# Altium project MainPanel.PrjPcb (part 1 of 2)
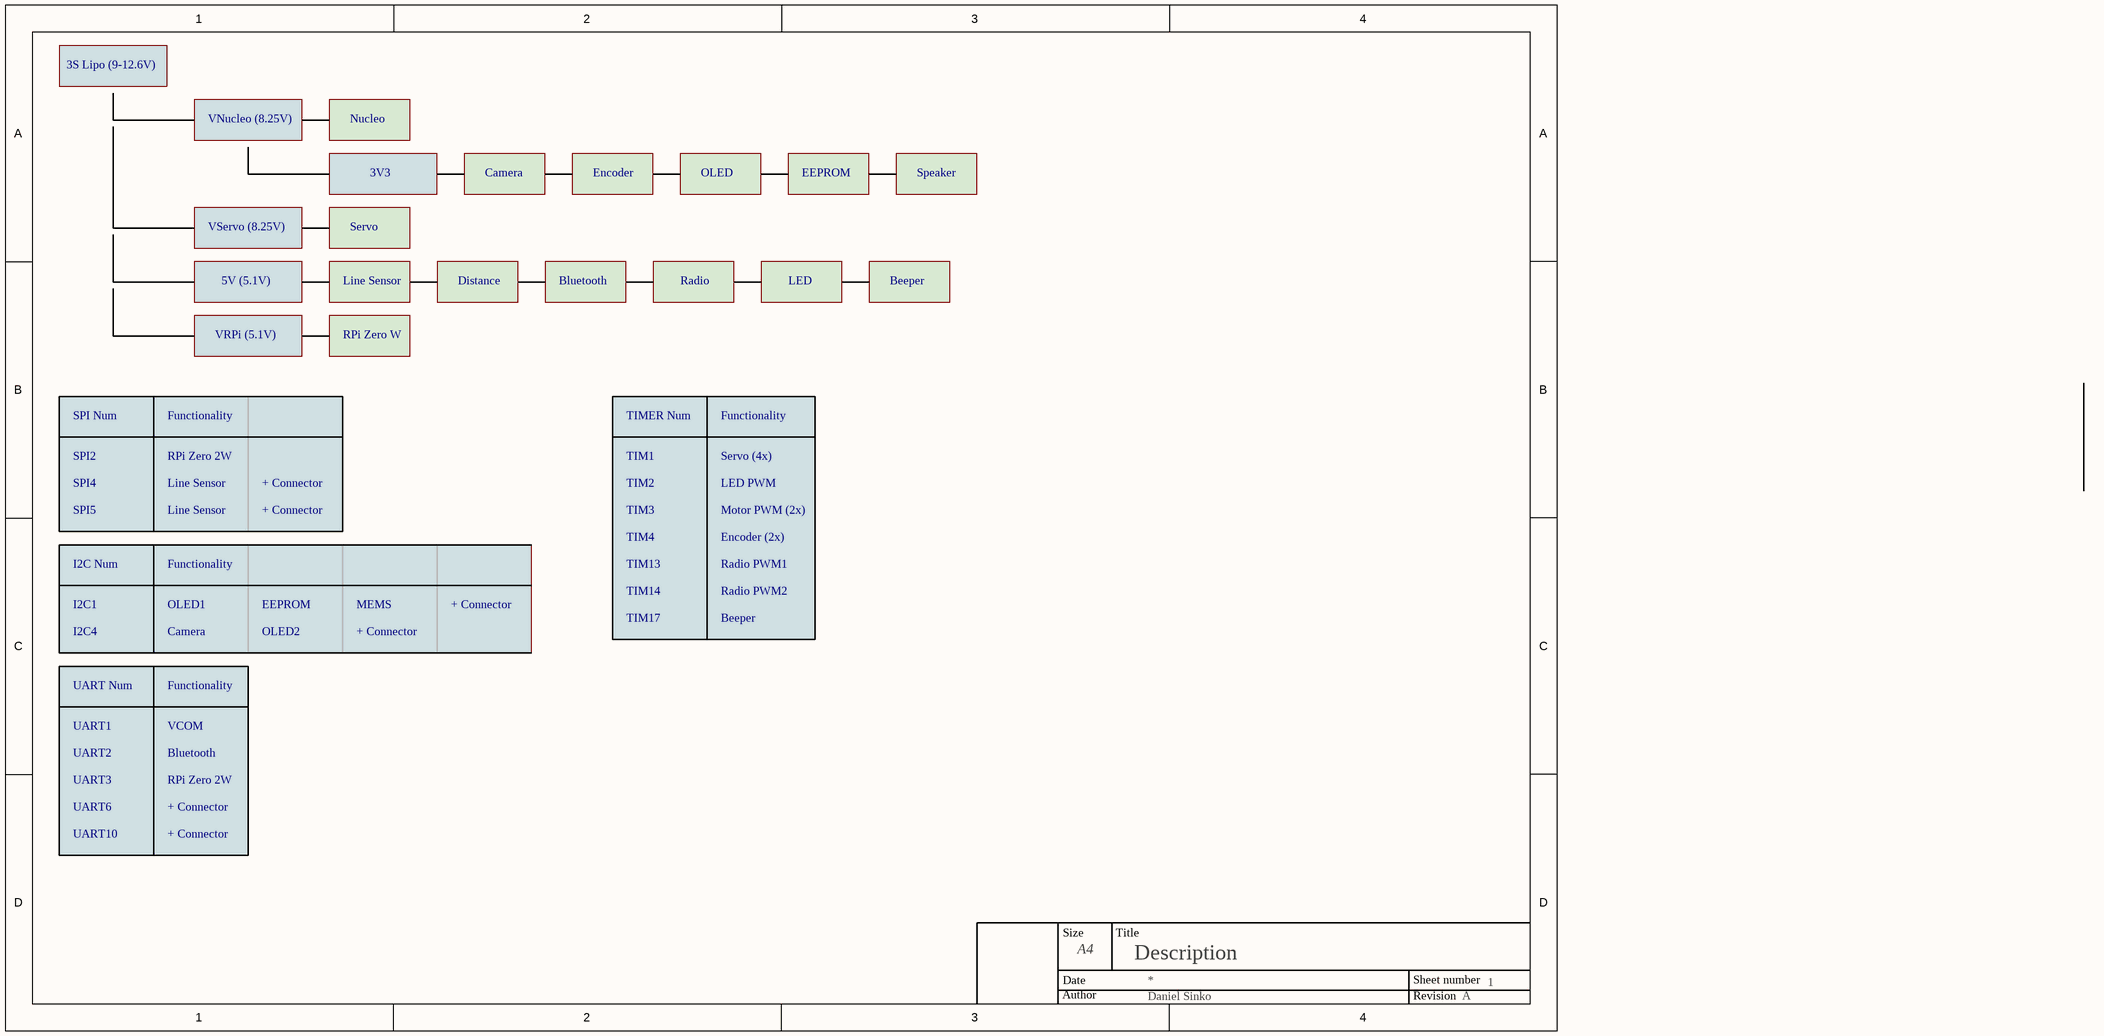
[diagram p0: Description.SchDoc]
15 sheets, 246 parts. Net scope: hierarchical (ports join the sheet entries above them; power ports are global).
Board file: MainPanel.PcbDoc
Sheets:
  Description.SchDoc
  Main.SchDoc
    U_EEPROM = EEPROM.SchDoc
    U_Interface = Interface.SchDoc
    U_Camera = Camera.SchDoc
    U_Communication = Communication.SchDoc
    U_Nucleo = Nucleo.SchDoc
    U_Measurements = Measurements.SchDoc
    U_Power = Power.SchDoc
    U_Encoder = Encoder.SchDoc
    U_Servo = Servo.SchDoc
    U_MotorDriver = MotorDriver.SchDoc
    U_Linesensor = Linesensor.SchDoc
    U_Linesensor = Linesensor.SchDoc
    U_DistanceSensor = DistanceSensor.SchDoc
  ledsbuttons.SchDoc

## Sheet Description.SchDoc: Description
size A4; Author: Daniel Sinko; Revision: A; SheetNumber: 1; SheetTotal: 15

### Notes on the sheet
- 3S Lipo (9-12.6V)
- VNucleo (8.25V)
- Nucleo
- 3V3
- Camera
- Encoder
- OLED
- EEPROM
- Speaker
- VServo (8.25V)
- Servo
- 5V (5.1V)
- Line Sensor
- Distance
- Bluetooth
- Radio
- LED
- Beeper
- VRPi (5.1V)
- RPi Zero W
- SPI Num
- Functionality
- TIMER Num
- SPI2
- SPI4
- SPI5
- RPi Zero 2W
- + Connector
- TIM1
- TIM2
- TIM3
- Servo (4x)
- LED PWM
- Motor PWM (2x)
- I2C Num
- TIM4
- TIM13
- Encoder (2x)
- Radio PWM1
- I2C1
- I2C4
- OLED1
- OLED2
- MEMS
- TIM14
- TIM17
- Radio PWM2
- UART Num
- UART1
- UART2
- UART3
- VCOM
- UART6
- UART10
- Size
- Date
- A4
- Title
- Sheet number
- Author
- Revision

## Sheet Main.SchDoc
size A4; SheetNumber: 2; SheetTotal: 15
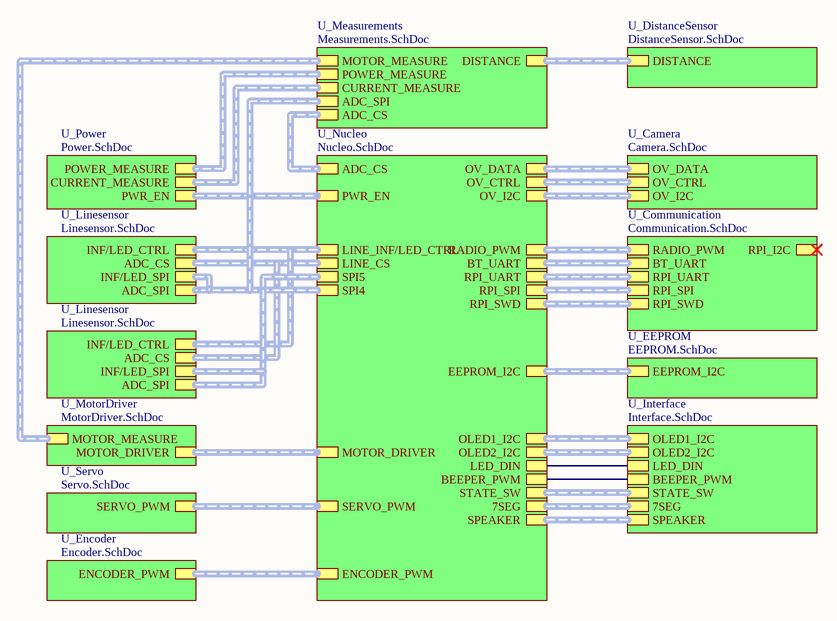
[diagram p1: Main.SchDoc]

### Sub-sheets
U_Camera = Camera.SchDoc: OV_DATA (harness OV_DATA), OV_I2C (harness OV_I2C), OV_CTRL (harness OV_CTRL)
U_Communication = Communication.SchDoc: BT_UART (harness BT_UART), RADIO_PWM (harness RADIO_PWM), RPI_I2C (harness RPi_I2C), RPI_UART (harness RPI_UART), RPI_SPI (harness RPi SPI), RPI_SWD (harness RPI_SWD)
U_DistanceSensor = DistanceSensor.SchDoc: DISTANCE (harness DISTANCE)
U_EEPROM = EEPROM.SchDoc: EEPROM_I2C (harness EEPROM_I2C)
U_Encoder = Encoder.SchDoc: ENCODER_PWM (harness ENCODER_PWM)
U_Interface = Interface.SchDoc: LED_DIN, BEEPER_PWM, STATE_SW, 7SEG, OLED1_I2C (harness OLED1), OLED2_I2C (harness OLED2), SPEAKER (harness SPEAKER)
U_Linesensor = Linesensor.SchDoc: INF/LED_CTRL (harness harness_line_inf), ADC_SPI (harness harness_spi), ADC_CS (harness harness_adc_cs), INF/LED_SPI (harness harness_spi)
U_Linesensor = Linesensor.SchDoc: INF/LED_CTRL (harness harness_line_inf), ADC_SPI (harness harness_spi), ADC_CS (harness harness_adc_cs), INF/LED_SPI (harness harness_spi)
U_Measurements = Measurements.SchDoc: POWER_MEASURE (harness POWER_MEASURE), DISTANCE (harness DISTANCE), MOTOR_MEASURE (harness MOTOR_MEASURE), ADC_SPI (harness ADC_SPI), ADC_CS (harness ADC_CS), CURRENT_MEASURE (harness CURRENT_MEASURE)
U_MotorDriver = MotorDriver.SchDoc: MOTOR_DRIVER (harness MOTOR_DRIVER), MOTOR_MEASURE (harness MOTOR_MEASURE)
U_Nucleo = Nucleo.SchDoc: OV_DATA (harness OV_DATA), LINE_INF/LED_CTRL (harness harness_line_inf), LINE_CS (harness harness_adc_cs), OV_CTRL (harness OV_CTRL), OV_I2C (harness OV_I2C), ENCODER_PWM (harness ENCODER_PWM), RADIO_PWM (harness RADIO_PWM), BT_UART (harness BT_UART), RPI_SPI (harness RPi SPI), RPI_UART (harness RPI_UART), PWR_EN (harness PWR_EN), SERVO_PWM (harness SERVO_PWM), MOTOR_DRIVER (harness MOTOR_DRIVER), LED_DIN, BEEPER_PWM, STATE_SW, 7SEG, RPI_SWD (harness RPI_SWD), EEPROM_I2C (harness EEPROM_I2C), OLED1_I2C (harness OLED1), OLED2_I2C (harness OLED2), SPEAKER (harness SPEAKER), ADC_CS (harness ADC_CS), SPI4 (harness harness_spi), SPI5 (harness harness_spi)
U_Power = Power.SchDoc: PWR_EN (harness PWR_EN), POWER_MEASURE (harness POWER_MEASURE), CURRENT_MEASURE (harness CURRENT_MEASURE)
U_Servo = Servo.SchDoc: SERVO_PWM (harness SERVO_PWM)

### Nets
TIM2_CH3: sheet U_Interface/LED_DIN, sheet U_Nucleo/LED_DIN
TIM17_CH1: sheet U_Interface/BEEPER_PWM, sheet U_Nucleo/BEEPER_PWM

### Buses and harness runs
harness sheet U_Camera/OV_CTRL = sheet U_Nucleo/OV_CTRL
harness sheet U_Camera/OV_DATA = sheet U_Nucleo/OV_DATA
harness sheet U_Camera/OV_I2C = sheet U_Nucleo/OV_I2C
harness sheet U_Communication/BT_UART = sheet U_Nucleo/BT_UART
harness sheet U_Communication/RADIO_PWM = sheet U_Nucleo/RADIO_PWM
harness sheet U_Communication/RPI_SPI = sheet U_Nucleo/RPI_SPI
harness sheet U_Communication/RPI_SWD = sheet U_Nucleo/RPI_SWD
harness sheet U_Communication/RPI_UART = sheet U_Nucleo/RPI_UART
harness sheet U_DistanceSensor/DISTANCE = sheet U_Measurements/DISTANCE
harness sheet U_EEPROM/EEPROM_I2C = sheet U_Nucleo/EEPROM_I2C
harness sheet U_Encoder/ENCODER_PWM = sheet U_Nucleo/ENCODER_PWM
harness sheet U_Interface/7SEG = sheet U_Nucleo/7SEG
harness sheet U_Interface/OLED1_I2C = sheet U_Nucleo/OLED1_I2C
harness sheet U_Interface/OLED2_I2C = sheet U_Nucleo/OLED2_I2C
harness sheet U_Interface/SPEAKER = sheet U_Nucleo/SPEAKER
harness sheet U_Interface/STATE_SW = sheet U_Nucleo/STATE_SW
harness sheet U_Linesensor/ADC_CS = sheet U_Nucleo/LINE_CS
harness sheet U_Linesensor/ADC_SPI = sheet U_Linesensor/INF/LED_SPI = sheet U_Measurements/ADC_SPI = sheet U_Nucleo/SPI4
harness sheet U_Linesensor/ADC_SPI = sheet U_Linesensor/INF/LED_SPI = sheet U_Nucleo/SPI5
harness sheet U_Linesensor/INF/LED_CTRL = sheet U_Nucleo/LINE_INF/LED_CTRL
harness sheet U_Measurements/ADC_CS = sheet U_Nucleo/ADC_CS
harness sheet U_Measurements/CURRENT_MEASURE = sheet U_Power/CURRENT_MEASURE
harness sheet U_Measurements/MOTOR_MEASURE = sheet U_MotorDriver/MOTOR_MEASURE
harness sheet U_Measurements/POWER_MEASURE = sheet U_Power/POWER_MEASURE
harness sheet U_MotorDriver/MOTOR_DRIVER = sheet U_Nucleo/MOTOR_DRIVER
harness sheet U_Nucleo/PWR_EN = sheet U_Power/PWR_EN
harness sheet U_Nucleo/SERVO_PWM = sheet U_Servo/SERVO_PWM

### Notes on the sheet
- Size
- Date
- A4
- Title
- Sheet number
- Author
- Revision

## Sheet EEPROM.SchDoc
size A4; SheetNumber: 13; SheetTotal: 15
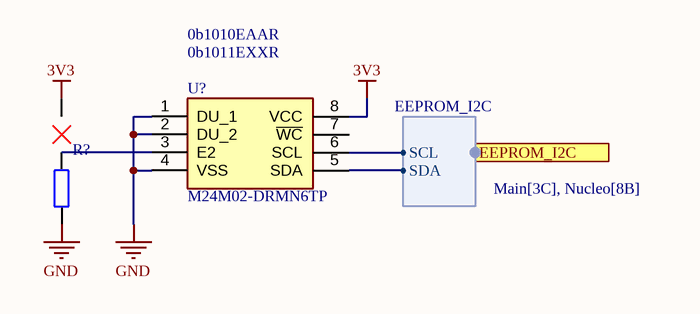
[diagram p2: EEPROM.SchDoc]

### Parts
(Parts that share a designator on the sheet are numbered #1, #2 ... from top to bottom, then left to right.)
R?#1  *  [RES0603 _SELECTION]  (value not drawn)
U?  M24M02-DRMN6TP  [SOIC127P600X175-8N]

### Ports
EEPROM_I2C (harness EEPROM_I2C, see Main[3C], Nucleo[8B])

### Harnesses
EEPROM_I2C: SCL, SDA

### Nets
3V3: R?#1.3 U?.8(VCC)
GND: R?#1.1 U?.1(DU_1) U?.2(DU_2) U?.4(VSS)
I2C1_SCA: U?.5(SDA) ; port EEPROM_I2C.SDA
I2C1_SCL: U?.6(SCL) ; port EEPROM_I2C.SCL
NetR?#1_2: R?#1.2 U?.3(E2)

Not connected (* = marked no-connect by the designer): U? 7(~{WC})

### Notes on the sheet
- 0b1010EAAR
- (near U?) 0b1011EXXR
- Size
- Date
- A4
- Title
- Sheet number
- Author
- Revision

### Library data of the parts
R?#1 = Resistor_Selection: Resistor; Value: *
U? = M24M02-DRMN6TP: Undefined or Miscellaneous; Manufacturer_Name: STMicroelectronics; Datasheet Link: http://www.st.com/content/ccc/resource/technical/document/datasheet/b7/de/9b/f6/03/28/4e/8e/CD00290537.pdf/files/CD00290537.pdf/jcr:content/translations/en.CD00290537.pdf; Height: 1.75mm; Manufacturer_Part_Number: M24M02-DRMN6TP; Mouser Part Number: 511-M24M02-DRMN6TP; Mouser Price/Stock: https://www.mouser.co.uk/ProductDetail/STMicroelectronics/M24M02-DRMN6TP?qs=0gj%2FgiofzsPtgZ8EdVfF5w%3D%3D; Arrow Part Number: M24M02-DRMN6TP; Arrow Price/Stock: https://www.arrow.com/en/products/m24m02-drmn6tp/stmicroelectronics?utm_currency=USD&region=nac

## Sheet Interface.SchDoc
size A4; SheetNumber: 12; SheetTotal: 15
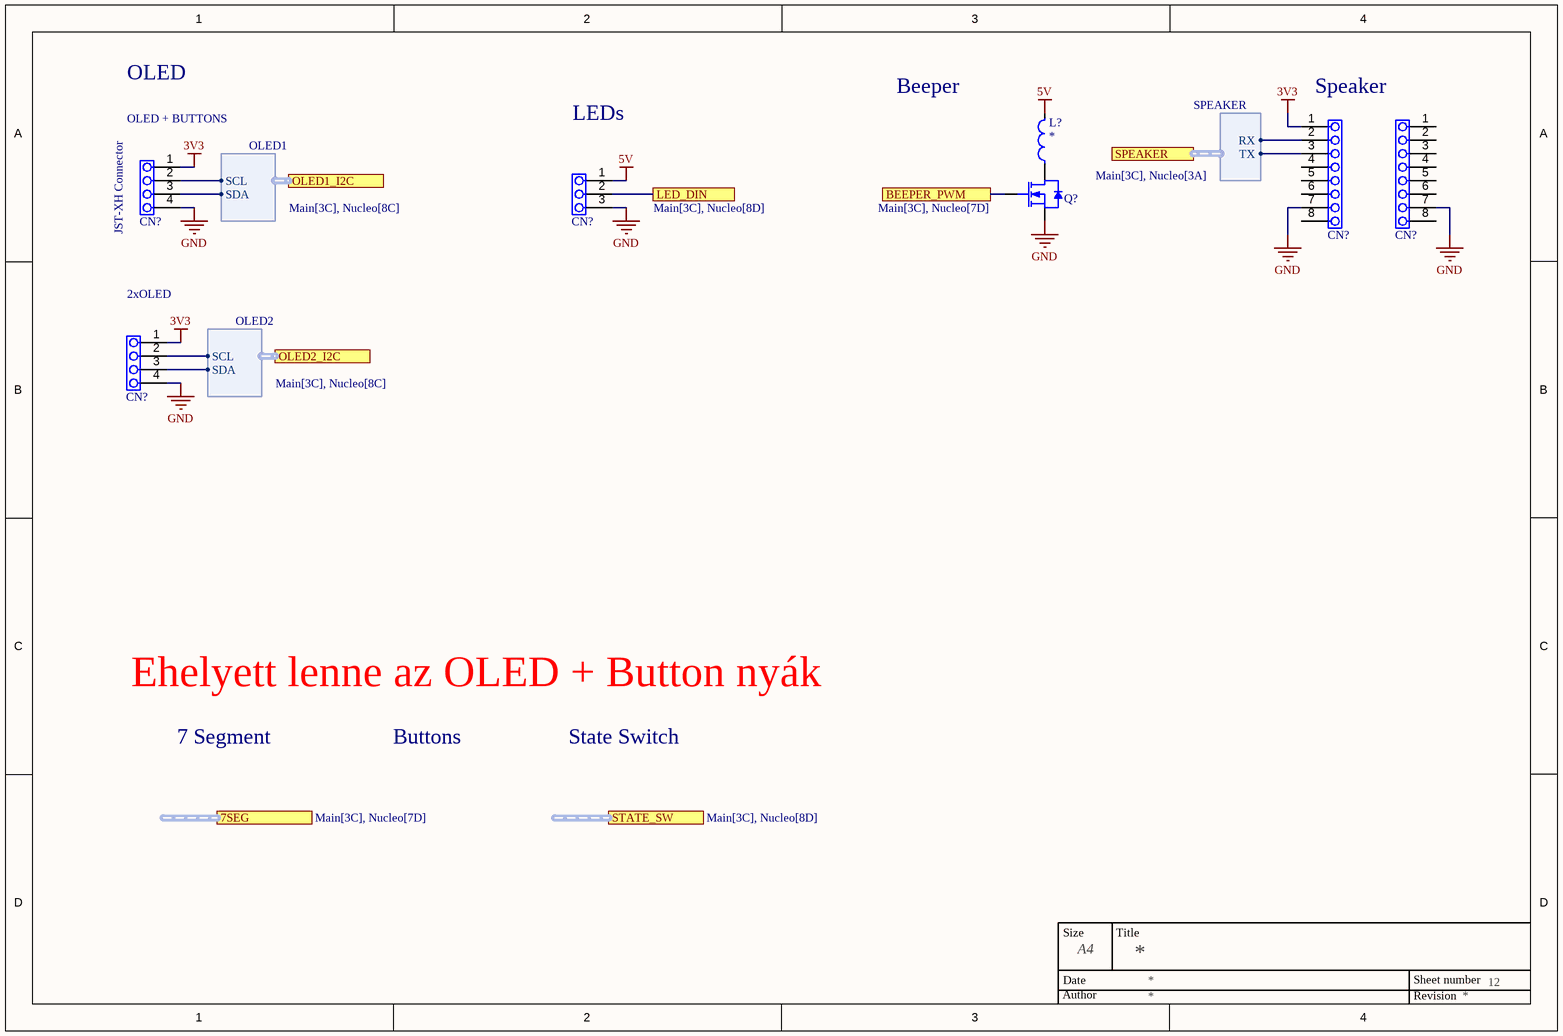
[diagram p3: Interface.SchDoc]

### Parts
(Parts that share a designator on the sheet are numbered #1, #2 ... from top to bottom, then left to right.)
CN?#1  Pin-1x8  [PIN-1X7]  (value not drawn)
CN?#2  Pin-1x8  [PIN-1X7]  (value not drawn)
CN?#3  Pins 1x3  [PIN-1X4]  (value not drawn)
CN?#4  Pins 1x3  [PIN-1X3]  (value not drawn)
CN?#5  Pins 1x3  [PIN-1X4]  (value not drawn)
L?#1  *
Q?#1  N-MOSFET  (value not drawn)

### Ports
7SEG (see Main[3C], Nucleo[7D]), BEEPER_PWM (see Main[3C], Nucleo[7D]), LED_DIN (see Main[3C], Nucleo[8D]), OLED1_I2C (harness OLED1, see Main[3C], Nucleo[8C]), OLED2_I2C (harness OLED2, see Main[3C], Nucleo[8C]), SPEAKER (harness SPEAKER, see Main[3C], Nucleo[3A]), STATE_SW (see Main[3C], Nucleo[8D])

### Harnesses
OLED1: SCL, SDA
OLED2: SCL, SDA
SPEAKER: RX, TX

### Nets
3V3: CN?#1.1 CN?#3.1 CN?#5.1
5V: CN?#4.1 L?#1.2
GND: CN?#1.7 CN?#2.7 CN?#3.4 CN?#4.3 CN?#5.4 Q?#1.2(S)
I2C1_SCA: CN?#3.3 ; port OLED1_I2C.SDA
I2C1_SCL: CN?#3.2 ; port OLED1_I2C.SCL
I2C4_SCA: CN?#5.3 ; port OLED2_I2C.SDA
I2C4_SCL: CN?#5.2 ; port OLED2_I2C.SCL
TIM2_CH3: CN?#4.2 ; port LED_DIN
TIM17_CH1: Q?#1.1(G) ; port BEEPER_PWM
UART6_RX: CN?#1.3 ; port SPEAKER.TX
UART6_TX: CN?#1.2 ; port SPEAKER.RX
NetL?#1_1: L?#1.1 Q?#1.3(D)

Not connected (* = marked no-connect by the designer): CN?#1 4 5 6 8; CN?#2 1 2 3 4 5 6 8

### Notes on the sheet
- OLED
- Beeper
- (near CN?#1) Speaker
- (near CN?#3) OLED + BUTTONS
- LEDs
- (near CN?#3) JST-XH Connector
- (near CN?#5) 2xOLED
- Ehelyett lenne az OLED + Button nyák
- 7 Segment
- Buttons
- State Switch
- Size
- Date
- A4
- Title
- Sheet number
- Author
- Revision

### Library data of the parts
CN?#1 CN?#2 = Pin-1x8: 2.54mm; Part Class: Connector; Order Code: 855-M50-3530342; CompType: M50-3530342; Distributor: Mouser; Package: SMD 1.27mm
CN?#3 CN?#5 = Pin-1x4: 2.54mm; Part Class: Connector; Order Code: 855-M50-3530342; CompType: M50-3530342; Distributor: Mouser; Package: SMD 1.27mm
CN?#4 = Pin-1x3: 2.54mm; Part Class: Connector; Order Code: 855-M50-3530342; CompType: M50-3530342; Distributor: Mouser; Package: SMD 1.27mm
L?#1 = Inductor: Value: *
Q?#1 = N-MOSFET: N channel MOSFET

## Sheet Camera.SchDoc
size A4; SheetNumber: 5; SheetTotal: 15
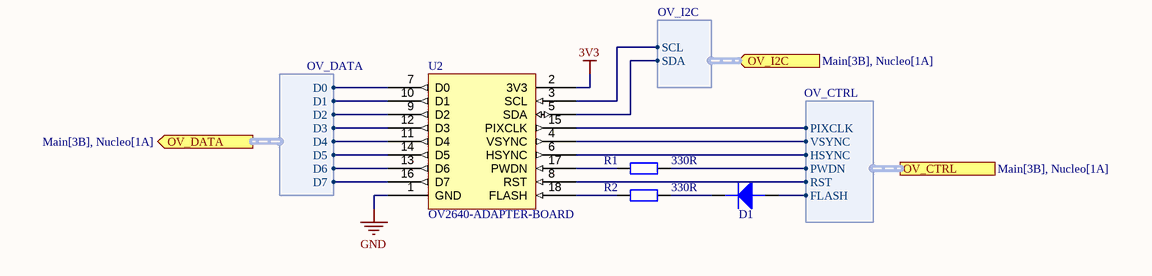
[diagram p4: Camera.SchDoc]

### Parts
D1  Diode  [DIOM4325X24M]  (value not drawn)
R1  330R  [FP_0805_RES]
R2  330R  [FP_0805_RES]
U2  OV2640-ADAPTER-BOARD  [CONNECTOR-18P - 90°]

### Ports
OV_CTRL (harness OV_CTRL, see Main[3B], Nucleo[1A]), OV_DATA (out, harness OV_DATA, see Main[3B], Nucleo[1A]), OV_I2C (in, harness OV_I2C, see Main[3B], Nucleo[1A])

### Harnesses
OV_DATA: D0, D1, D2, D3, D4, D5, D6, D7
OV_I2C: SCL, SDA
OV_CTRL: PIXCLK, VSYNC, HSYNC, RST, PWDN, FLASH

### Nets
3V3: U2.2(3V3)
GND: U2.1(GND)
I2C4_SCL: U2.3(SCL) ; port OV_I2C.SCL
I2C4_SDA: U2.5(SDA) ; port OV_I2C.SDA
OV_D0: U2.7(D0) ; port OV_DATA.D0
OV_D1: U2.10(D1) ; port OV_DATA.D1
OV_D2: U2.9(D2) ; port OV_DATA.D2
OV_D3: U2.12(D3) ; port OV_DATA.D3
OV_D4: U2.11(D4) ; port OV_DATA.D4
OV_D5: U2.14(D5) ; port OV_DATA.D5
OV_D6: U2.13(D6) ; port OV_DATA.D6
OV_D7: U2.16(D7) ; port OV_DATA.D7
OV_FLASH: D1.2(A) ; port OV_CTRL.FLASH
OV_HSYNC: U2.6(HSYNC) ; port OV_CTRL.HSYNC
OV_PIXCLK: U2.15(PIXCLK) ; port OV_CTRL.PIXCLK
OV_PWDN: R1.2 ; port OV_CTRL.PWDN
OV_RST: U2.8(RST) ; port OV_CTRL.RST
OV_VSYNC: U2.4(VSYNC) ; port OV_CTRL.VSYNC
NetD1_1: D1.1(K) R2.2
NetR1_1: R1.1 U2.17(PWDN)
NetR2_1: R2.1 U2.18(FLASH)

### Notes on the sheet
- Size
- Date
- A4
- Title
- Sheet number
- Author
- Revision

### Library data of the parts
D1 = Diode: Name: 1A 40V DO-214AC SCH.RECT. SS14 (YET) SMA-W; Supplier: Lomex; Reference: 83-02-47
R1 R2 = RES: Resistor; Name: 330R 0805 5% CR-05JL7--330R 0.125W (VIK); Supplier: Lomex; Reference: 81-10-81; Value: 330R
U2 = OV2640-ADAPTER-BOARD: Adapter board for OV2640 camera modul; Name: ZL231-18KG; Reference: 100.480.07; Supplier: hestore

## Sheet Communication.SchDoc
size A4; SheetNumber: 11; SheetTotal: 15
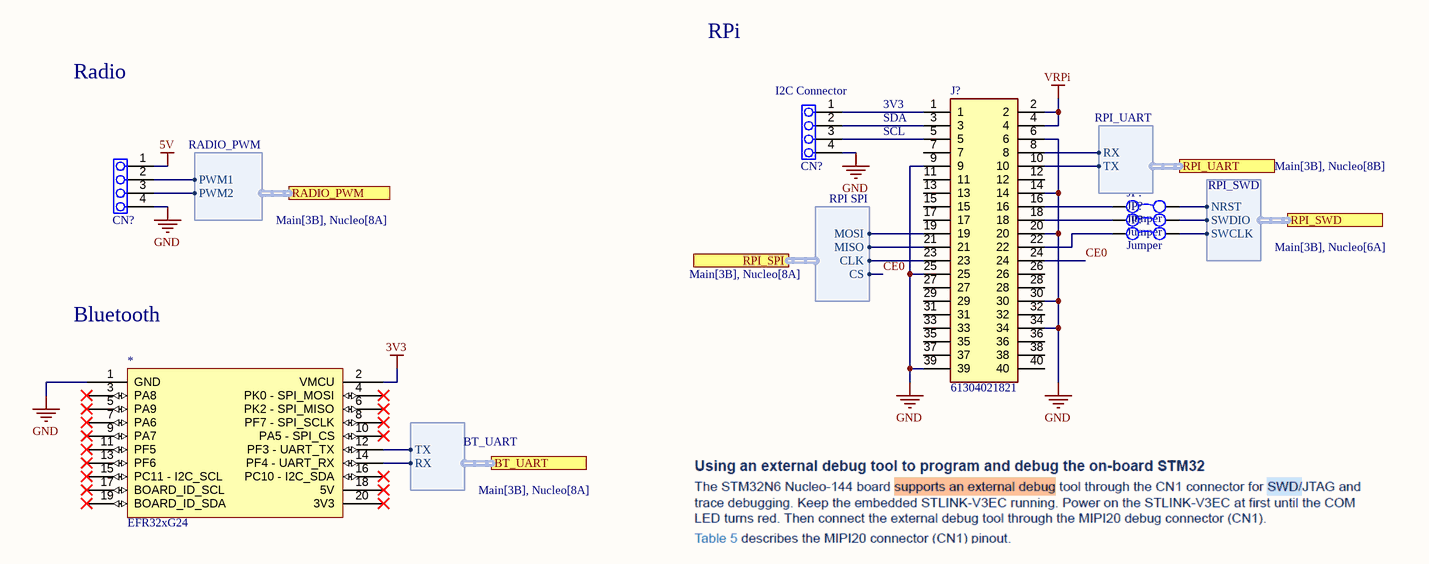
[diagram p5: Communication.SchDoc]

### Parts
(Parts that share a designator on the sheet are numbered #1, #2 ... from top to bottom, then left to right.)
*  EFR32xG24
CN?#6  Pins 1x3  [PIN-1X4]  (value not drawn)
CN?#7  Pins 1x3  [PIN-1X4]  (value not drawn)
J?#1  61304021821  [RHDR40W97P254X254_2X20_5130X508X860P]
JP?#1  Jumper  [PIN-1X2]
JP?#2  Jumper  [PIN-1X2]
JP?#3  Jumper  [PIN-1X2]

### Ports
BT_UART (harness BT_UART, see Main[3B], Nucleo[8A]), RADIO_PWM (harness RADIO_PWM, see Main[3B], Nucleo[8A]), RPI_SPI (harness RPi SPI, see Main[3B], Nucleo[8A]), RPI_SWD (harness RPI_SWD, see Main[3B], Nucleo[6A]), RPI_UART (harness RPI_UART, see Main[3B], Nucleo[8B])

### Harnesses
RADIO_PWM: PWM1, PWM2
RPI_UART: RX, TX
RPI SPI: CS, MOSI, MISO, CLK
RPI_SWD: NRST, SWDIO, SWCLK
BT_UART: RX, TX

### Nets
3V3: *.2(VMCU)
5V: CN?#7.1
GND: *.1(GND) CN?#6.4 CN?#7.4 J?#1.6 J?#1.9 J?#1.14 J?#1.20 J?#1.25 J?#1.30 J?#1.34 J?#1.39
VRPi: J?#1.2 J?#1.4
CE0: J?#1.24 ; port RPI_SPI.CS
SPI2_CLK: J?#1.23 ; port RPI_SPI.CLK
SPI2_MISO: J?#1.21 ; port RPI_SPI.MISO
SPI2_MOSI: J?#1.19 ; port RPI_SPI.MOSI
TIM13_CH1: CN?#7.2 ; port RADIO_PWM.PWM1
TIM14_CH1: CN?#7.3 ; port RADIO_PWM.PWM2
UART2_RX: *.12(PF3_-_UART_TX) ; port BT_UART.TX
UART2_TX: *.14(PF4_-_UART_RX) ; port BT_UART.RX
UART3_RX: J?#1.10 ; port RPI_UART.TX
UART3_TX: J?#1.8 ; port RPI_UART.RX
NetCN?#6_1: CN?#6.1 J?#1.1
NetCN?#6_2: CN?#6.2 J?#1.3
NetCN?#6_3: CN?#6.3 J?#1.5
NetJ?#1_16: J?#1.16 JP?#1.1
NetJ?#1_18: J?#1.18 JP?#2.1
NetJ?#1_22: J?#1.22 JP?#3.1
NetJ?#2_2: JP?#2.2 ; port RPI_SWD.SWDIO
NetJ?#2_4: JP?#3.2 ; port RPI_SWD.SWCLK
NetJ?#2_10: JP?#1.2 ; port RPI_SWD.NRST

Not connected (* = marked no-connect by the designer): * 3(PA8)* 4(PK0_-_SPI_MOSI)* 5(PA9)* 6(PK2_-_SPI_MISO)* 7(PA6)* 8(PF7_-_SPI_SCLK)* 9(PA7)* 10(PA5_-_SPI_CS)* 11(PF5)* 13(PF6)* 15(PC11_-_I2C_SCL)* 16(PC10_-_I2C_SDA)* 17(BOARD_ID_SCL)* 18(5V)* 19(BOARD_ID_SDA)* 20(3V3)*; J?#1 7 11 12 13 15 17 26 27 28 29 31 32 33 35 36 37 38 40

### Notes on the sheet
- RPi
- Radio
- (near CN?#6) I2C Connector
- 3V3
- SDA
- SCL
- Bluetooth
- Size
- Date
- A4
- Title
- Sheet number
- Author
- Revision

### Library data of the parts
CN?#6 CN?#7 = Pin-1x4: as CN?#3 on sheet Interface; Distributor: Mouser; Package: SMD 1.27mm
J?#1 = 61304021821: Connector; Manufacturer_Name: Wurth Elektronik; Datasheet Link: https://componentsearchengine.com/Datasheets/1/61304021821.pdf; Height: 8.6mm; Manufacturer_Part_Number: 61304021821; Mouser Part Number: 710-61304021821; Mouser Price/Stock: https://www.mouser.co.uk/ProductDetail/Wurth-Elektronik/61304021821?qs=bZr6mbWTK5mzEvTTGhcEyQ%3D%3D
JP?#1-JP?#3 = Jumper: Interconnection Device; Manufacturer: Harwin; Manufacturer Part Number: M7582-46; Manufacturer Series: M75; Additional Feature: ROHS COMPLIANT; Body/Shell Style: PLUG; Contact Pattern: RECTANGULAR; Contact Resistance: 20mR; Contact Style: SQ PIN-SKT; Dielectric Withstanding Voltage (AC): 500V; Insertion Force-Max: 6.672N; Insulation Resistance: 5GR; Number Of Connectors: 1; Rated Current (Signal): 1A; Number of Contacts: 2; Body Breadth: 0.094inch; Body Depth: 0.236inch; Body Length: 0.197inch; Mating Contact Pitch: 0.1inch; Reference Standard: UL; Reliability: COMMERCIAL; Supplier: Mouser; Supplier Part Number: 855-M7582-46; RoHS: Yes; Category: Uncategorized; Stock: 4991; Pricing: 1=0.19, 10=0.125, 50=0.125, 100=0.104, 1000=0.075, 10000=0.072 (USD); Contact Material: Bronze; Contact Finish - Mating: SN; Contact Finish - Termination: Tin (Sn); Insulation Color: Black; Insulation Material: Glass; Min Operating Temperature: -55°C; Max Operating Temperature: 105°C; Connector Type: Interconnection Device; JESD-609 Code: e3; Contact Gender: Female; Mounting Style: STRAIGHT; Number of Rows Loaded: 1; Reach SVHC Compliant: Yes; RoHS Compliant: Yes; ComponentLink1URL: https://datasheet.ciiva.com:443/pdfs/VipMasterIC/IC/HRWN/HRWNS06295/HRWNS06295-1.pdf?src-supplier=IHS+Markit; ComponentLink1Description: https://datasheet.ciiva.com:443/pdfs/VipMasterIC/IC/HRWN/HRWNS06295/HRWNS06295-1.pdf?src-supplier=IHS+Markit; ComponentLink2URL: http://www.mouser.com/ds/2/181/M7580-M7583-351524.pdf?src-supplier=Mouser; ComponentLink2Description: http://www.mouser.com/ds/2/181/M7580-M7583-351524.pdf?src-supplier=Mouser; ComponentLink3URL: https://cdn.harwin.com/pdfs/Harwin_PC_Connectors_M20.pdf?src-supplier=Digikey; ComponentLink3Description: https://cdn.harwin.com/pdfs/Harwin_PC_Connectors_M20.pdf?src-supplier=Digikey; ComponentLink4URL: http://www.harwin.com/include/downloads/pdfs/2010PAGE125.PDF?src-supplier=Avnet; ComponentLink4Description: http://www.harwin.com/include/downloads/pdfs/2010PAGE125.PDF?src-supplier=Avnet

## Sheet Nucleo.SchDoc
size A3; SheetNumber: 3; SheetTotal: 15
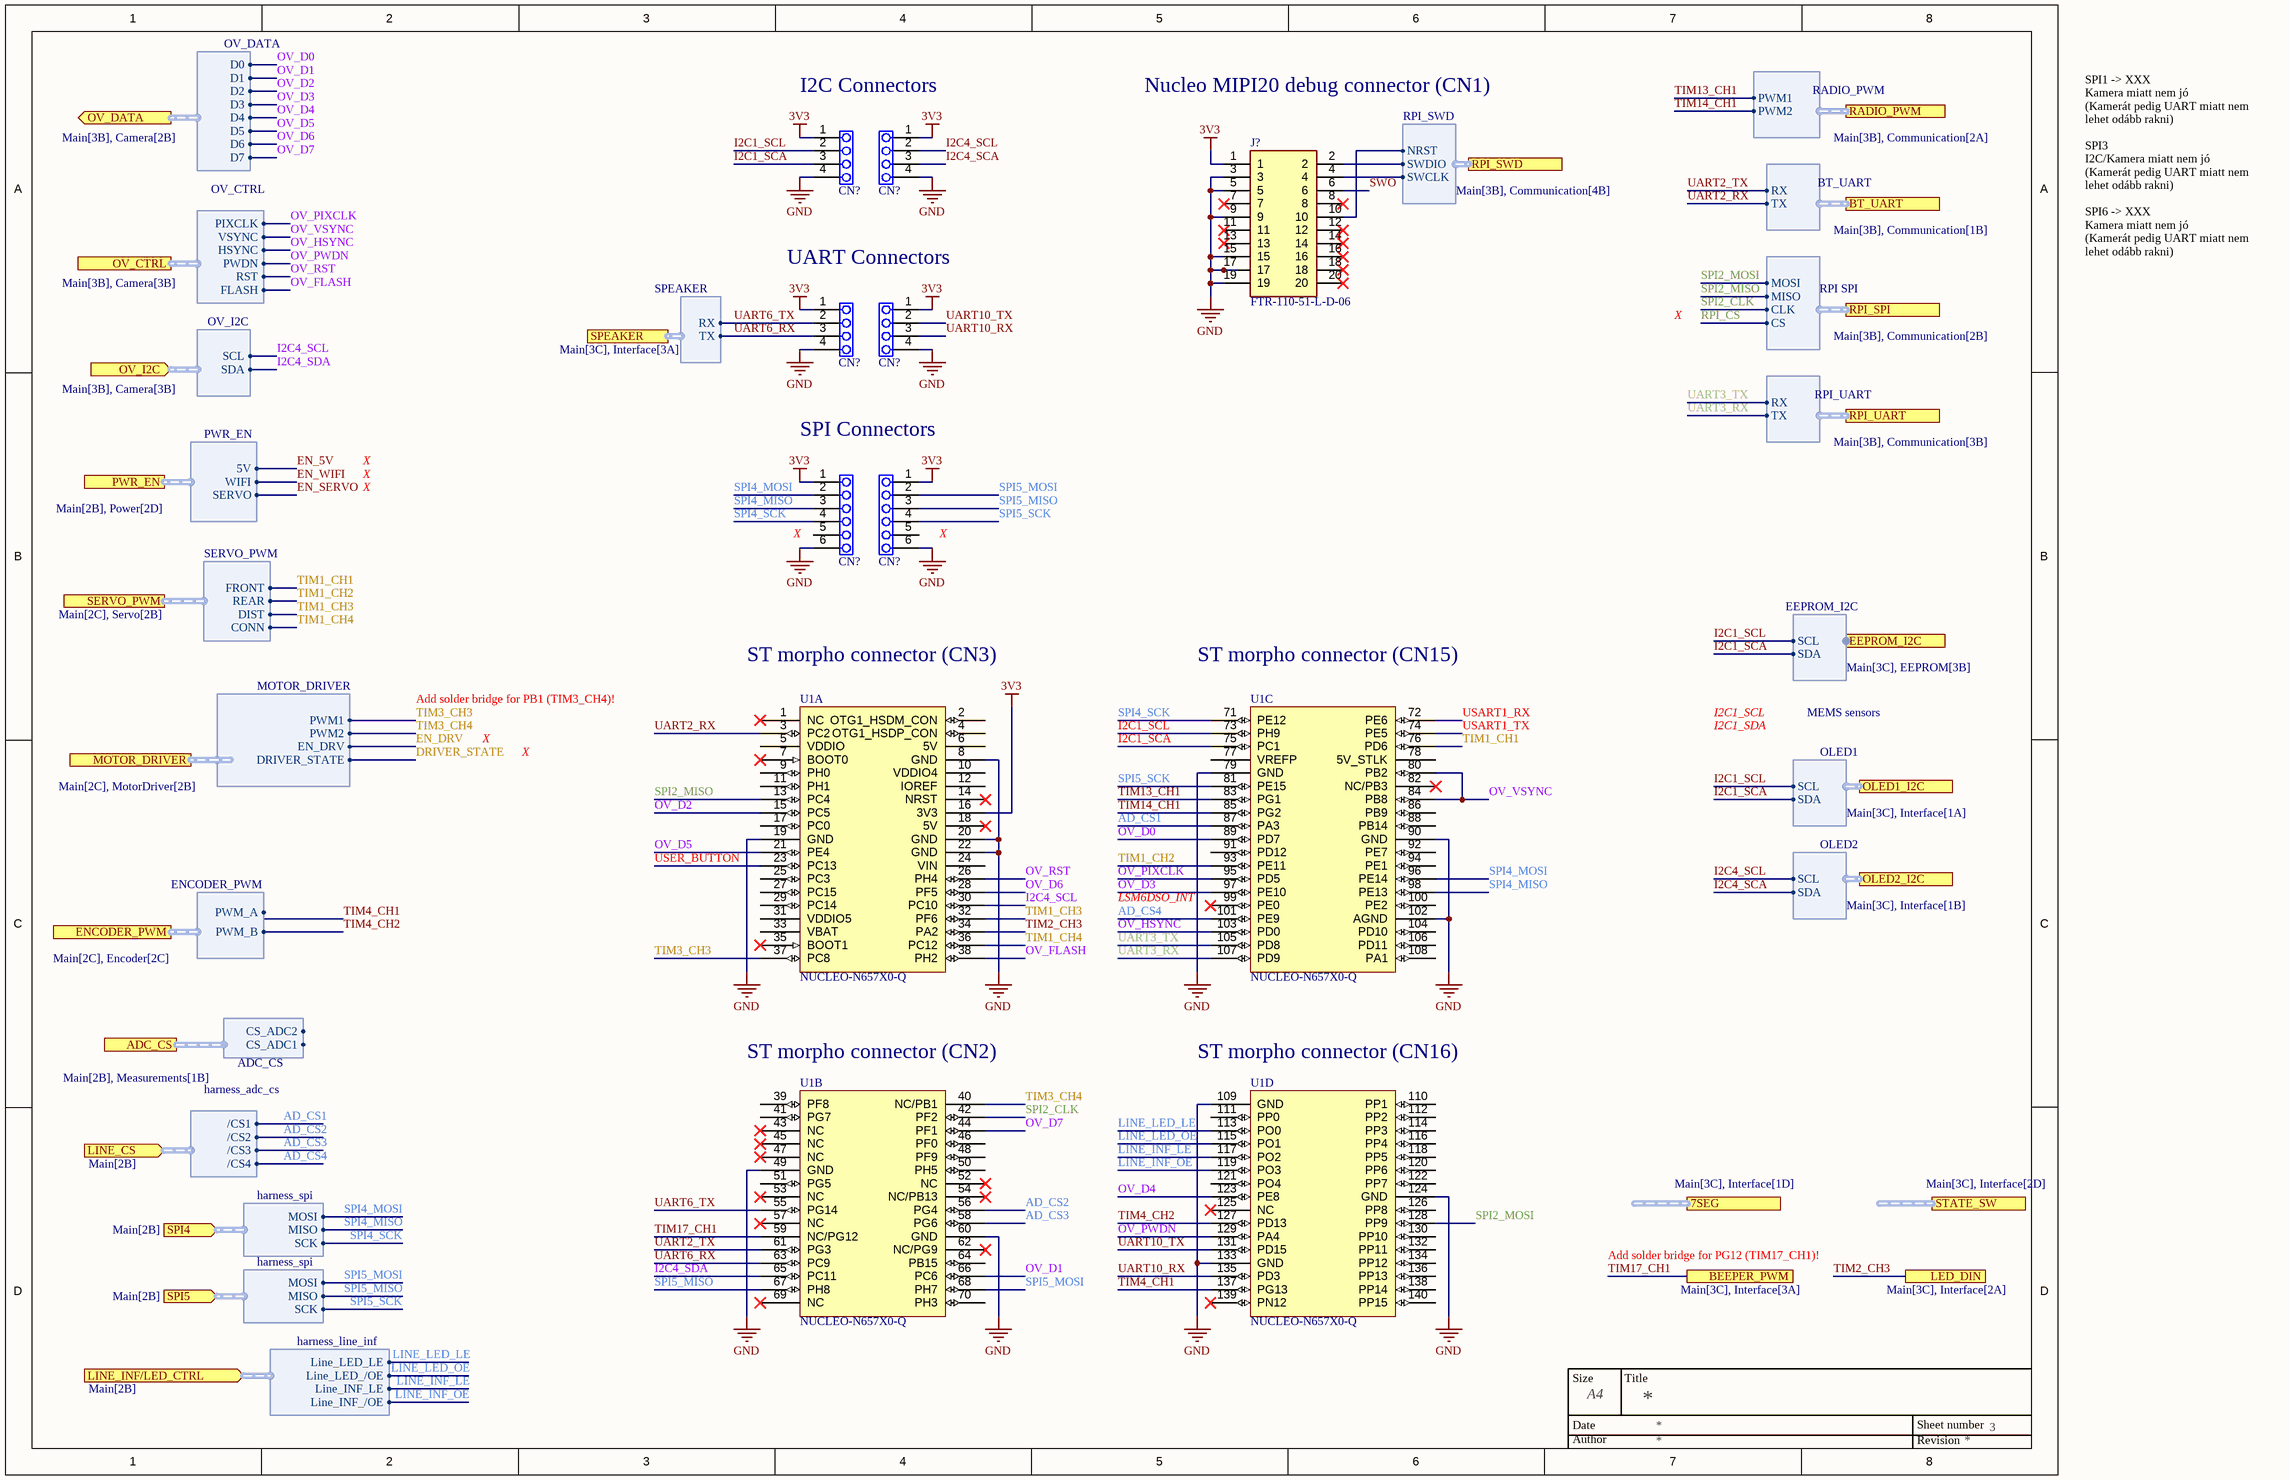
[diagram p6: Nucleo.SchDoc]

### Parts
(Parts that share a designator on the sheet are numbered #1, #2 ... from top to bottom, then left to right.)
CN?#8  Pins 1x3  [PIN-1X4]  (value not drawn)
CN?#9  Pins 1x3  [PIN-1X4]  (value not drawn)
CN?#10  Pins 1x3  [PIN-1X4]  (value not drawn)
CN?#11  Pins 1x3  [PIN-1X4]  (value not drawn)
CN?#12  Pins 1x3  [PIN-1X6]  (value not drawn)
CN?#13  Pins 1x3  [PIN-1X6]  (value not drawn)
J?#2  FTR-110-51-L-D-06  [HUSSP20W46P254X127_2X10_1270X498X737P]
U1  NUCLEO-N657X0-Q  [FP_NUCLEO-144 - N6]  (parts A,B,C,D of 4)

### Ports
7SEG (see Main[3C], Interface[1D]), ADC_CS (harness ADC_CS, see Main[2B], Measurements[1B]), BEEPER_PWM (see Main[3C], Interface[3A]), BT_UART (harness BT_UART, see Main[3B], Communication[1B]), EEPROM_I2C (harness EEPROM_I2C, see Main[3C], EEPROM[3B]), ENCODER_PWM (harness ENCODER_PWM, see Main[2C], Encoder[2C]), LED_DIN (see Main[3C], Interface[2A]), LINE_CS (in, harness harness_adc_cs, see Main[2B]), LINE_INF/LED_CTRL (in, harness harness_line_inf, see Main[2B]), MOTOR_DRIVER (harness MOTOR_DRIVER, see Main[2C], MotorDriver[2B]), OLED1_I2C (harness OLED1, see Main[3C], Interface[1A]), OLED2_I2C (harness OLED2, see Main[3C], Interface[1B]), OV_CTRL (harness OV_CTRL, see Main[3B], Camera[3B]), OV_DATA (out, harness OV_DATA, see Main[3B], Camera[2B]), OV_I2C (in, harness OV_I2C, see Main[3B], Camera[3B]), PWR_EN (harness PWR_EN, see Main[2B], Power[2D]), RADIO_PWM (harness RADIO_PWM, see Main[3B], Communication[2A]), RPI_SPI (harness RPi SPI, see Main[3B], Communication[2B]), RPI_SWD (harness RPI_SWD, see Main[3B], Communication[4B]), RPI_UART (harness RPI_UART, see Main[3B], Communication[3B]), SERVO_PWM (harness SERVO_PWM, see Main[2C], Servo[2B]), SPEAKER (harness SPEAKER, see Main[3C], Interface[3A]), SPI4 (in, harness harness_spi, see Main[2B]), SPI5 (in, harness harness_spi, see Main[2B]), STATE_SW (see Main[3C], Interface[2D])

### Harnesses
OV_DATA: D0, D1, D2, D3, D4, D5, D6, D7
harness_spi: MOSI, MISO, SCK
harness_line_inf: Line_LED_LE, Line_INF_LE, Line_INF_/OE, Line_LED_/OE
harness_adc_cs: /CS2, /CS1, /CS3, /CS4
OV_CTRL: PIXCLK, VSYNC, HSYNC, RST, PWDN, FLASH
OV_I2C: SCL, SDA
RADIO_PWM: PWM1, PWM2
BT_UART: RX, TX
RPI SPI: CS, MOSI, MISO, CLK
RPI_UART: RX, TX
PWR_EN: 5V, WIFI, SERVO
RPI_SWD: NRST, SWDIO, SWCLK
EEPROM_I2C: SCL, SDA
OLED1: SCL, SDA
OLED2: SCL, SDA
SERVO_PWM: REAR, FRONT, DIST, CONN
SPEAKER: RX, TX
ENCODER_PWM: PWM_A, PWM_B
ADC_CS: CS_ADC2, CS_ADC1
MOTOR_DRIVER: PWM1, PWM2, EN_DRV, DRIVER_STATE

### Nets
3V3: CN?#8.1 CN?#9.1 CN?#10.1 CN?#11.1 CN?#12.1 CN?#13.1 J?#2.1 U1.16(3V3)
GND: CN?#8.4 CN?#9.4 CN?#10.4 CN?#11.4 CN?#12.6 CN?#13.6 J?#2.3 J?#2.5 J?#2.9 J?#2.15 J?#2.17 J?#2.19 U1.8(GND) U1.19(GND) U1.20(GND) U1.22(GND) U1.49(GND) U1.60(GND) U1.79(GND) U1.90(GND) U1.102(AGND) U1.109(GND) U1.124(GND) U1.133(GND)
AD_CS1: U1.87(PA3) ; port LINE_CS./CS1
AD_CS2: U1.56(PG4) ; port LINE_CS./CS2
AD_CS3: U1.58(PG6) ; port LINE_CS./CS3
AD_CS4: U1.101(PE9) ; port LINE_CS./CS4
EN_WIFI: port PWR_EN.WIFI
I2C1_SCA: CN?#8.3 U1.75(PC1) ; port EEPROM_I2C.SDA, port OLED1_I2C.SDA
I2C1_SCL: CN?#8.2 U1.73(PH9) ; port EEPROM_I2C.SCL, port OLED1_I2C.SCL
I2C4_SCA: CN?#9.3 ; port OLED2_I2C.SDA
I2C4_SCL: CN?#9.2 U1.30(PC10) ; port OV_I2C.SCL, port OLED2_I2C.SCL
I2C4_SDA: U1.65(PC11) ; port OV_I2C.SDA
LINE_INF_LE: U1.117(PO2) ; port LINE_INF/LED_CTRL.Line_INF_LE  [project net CONN_INF_LE]
LINE_INF_OE: U1.119(PO3) ; port LINE_INF/LED_CTRL.Line_INF_/OE  [project net CONN_INF_/OE]
LINE_LED_LE: U1.113(PO0) ; port LINE_INF/LED_CTRL.Line_LED_LE  [project net CONN_LED_LE]
LINE_LED_OE: U1.115(PO1) ; port LINE_INF/LED_CTRL.Line_LED_/OE  [project net CONN_LED_/OE]
OV_D0: U1.89(PD7) ; port OV_DATA.D0
OV_D1: U1.66(PC6) ; port OV_DATA.D1
OV_D2: U1.15(PC5) ; port OV_DATA.D2
OV_D3: U1.97(PE10) ; port OV_DATA.D3
OV_D4: U1.123(PE8) ; port OV_DATA.D4
OV_D5: U1.21(PE4) ; port OV_DATA.D5
OV_D6: U1.28(PF5) ; port OV_DATA.D6
OV_D7: U1.44(PF1) ; port OV_DATA.D7
OV_FLASH: U1.38(PH2) ; port OV_CTRL.FLASH
OV_HSYNC: U1.103(PD0) ; port OV_CTRL.HSYNC
OV_PIXCLK: U1.95(PD5) ; port OV_CTRL.PIXCLK
OV_PWDN: U1.129(PA4) ; port OV_CTRL.PWDN
OV_RST: U1.26(PH4) ; port OV_CTRL.RST
OV_VSYNC: U1.80(PB2) U1.84(PB8) ; port OV_CTRL.VSYNC
SPI2_CLK: U1.42(PF2) ; port RPI_SPI.CLK
SPI2_MISO: U1.13(PC4) ; port RPI_SPI.MISO
SPI2_MOSI: U1.128(PP9) ; port RPI_SPI.MOSI
SPI4_MISO: CN?#12.3 U1.98(PE13) ; port SPI4.MISO  [project net CONN_AD_MISO]
SPI4_MOSI: CN?#12.2 U1.96(PE14) ; port SPI4.MOSI  [project net CONN_AD_MOSI]
SPI4_SCK: CN?#12.4 U1.71(PE12) ; port SPI4.SCK  [project net CONN_AD_SCK]
SPI5_MISO: CN?#13.3 U1.67(PH8) ; port SPI5.MISO  [project net CONN_AD_MISO]
SPI5_MOSI: CN?#13.2 U1.68(PH7) ; port SPI5.MOSI  [project net CONN_AD_MOSI]
SPI5_SCK: CN?#13.4 U1.81(PE15) ; port SPI5.SCK  [project net CONN_AD_SCK]
SWO: J?#2.6
TIM1_CH1: U1.76(PD6) ; port SERVO_PWM.FRONT  [project net SERVO_FRONT]
TIM1_CH2: U1.93(PE11) ; port SERVO_PWM.REAR  [project net SERVO_REAR]
TIM1_CH3: U1.32(PF6) ; port SERVO_PWM.DIST  [project net SERVO_DIST]
TIM1_CH4: U1.36(PC12) ; port SERVO_PWM.CONN  [project net SERVO_CONN]
TIM2_CH3: U1.34(PA2) ; port LED_DIN
TIM3_CH3: U1.37(PC8) ; port MOTOR_DRIVER.PWM1
TIM3_CH4: U1.40(NC/PB1) ; port MOTOR_DRIVER.PWM2
TIM4_CH1: U1.137(PG13)
TIM4_CH2: U1.127(PD13) ; port ENCODER_PWM.PWM_B
TIM13_CH1: U1.83(PG1) ; port RADIO_PWM.PWM1
TIM14_CH1: U1.85(PG2) ; port RADIO_PWM.PWM2
TIM17_CH1: U1.59(NC/PG12) ; port BEEPER_PWM
UART2_RX: U1.3(PC2) ; port BT_UART.TX
UART2_TX: U1.61(PG3) ; port BT_UART.RX
UART3_RX: U1.107(PD9) ; port RPI_UART.TX
UART3_TX: U1.105(PD8) ; port RPI_UART.RX
UART6_RX: CN?#10.3 U1.63(PC9) ; port SPEAKER.TX
UART6_TX: CN?#10.2 U1.55(PG14) ; port SPEAKER.RX
UART10_RX: CN?#11.3 U1.135(PD3)
UART10_TX: CN?#11.2 U1.131(PD15)
USART1_RX: U1.72(PE6)
USART1_TX: U1.74(PE5)
USER_BUTTON: U1.23(PC13)
NetJ?#2_2: J?#2.2 ; port RPI_SWD.SWDIO
NetJ?#2_4: J?#2.4 ; port RPI_SWD.SWCLK
NetJ?#2_10: J?#2.10 ; port RPI_SWD.NRST

Not connected (* = marked no-connect by the designer): CN?#12 5; CN?#13 5; J?#2 7* 8* 11* 12* 13* 14* 16* 18* 20*; U1 1(NC)* 2(OTG1_HSDM_CON) 4(OTG1_HSDP_CON) 5(VDDIO) 6(5V) 7(BOOT0)* 9(PH0) 10(VDDIO4) 11(PH1) 12(IOREF) 14(NRST)* 17(PC0) 18(5V)* 24(VIN) 25(PC3) 27(PC15) 29(PC14) 31(VDDIO5) 33(VBAT) 35(BOOT1)* 39(PF8) 41(PG7) 43(NC)* 45(NC)* 46(PF0) 47(NC)* 48(PF9) 50(PH5) 51(PG5) 52(NC)* 53(NC)* 54(NC/PB13)* 57(NC)* 62(NC/PG9)* 64(PB15) 69(NC)* 70(PH3) 77(VREFP) 78(5V_STLK) 82(NC/PB3)* 86(PB9) 88(PB14) 91(PD12) 92(PE7) 94(PE1) 99(PE0)* 100(PE2) 104(PD10) 106(PD11) 108(PA1) 110(PP1) 111(PP0) 112(PP2) 114(PP3) 116(PP4) 118(PP5) 120(PP6) 121(PO4) 122(PP7) 125(NC)* 126(PP8) 130(PP10) 132(PP11) 134(PP12) 136(PP13) 138(PP14) 139(PN12)* 140(PP15)

### Notes on the sheet
- (near CN?#8) I2C Connectors
- Nucleo MIPI20 debug connector (CN1)
- (near CN?#10) UART Connectors
- SPI1 -> XXX
  Kamera miatt nem jó
  (Kamerát pedig UART miatt nem lehet odább rakni)
  SPI3
  I2C/Kamera miatt nem jó
  (Kamerát pedig UART miatt nem lehet odább rakni)
  SPI6 -> XXX
  Kamera miatt nem jó
  (Kamerát pedig UART miatt nem lehet odább rakni)
- X
- (near CN?#13) SPI Connectors
- (near CN?#12) X
- (near CN?#13) X
- ST morpho connector (CN3)
- ST morpho connector (CN15)
- I2C1_SCL
- I2C1_SDA
- MEMS sensors
- LSM6DSO_INT
- (near U1) ST morpho connector (CN2)
- (near U1) ST morpho connector (CN16)
- Labels drawn without touching a wire or pin: Add solder bridge for PB1 (TIM3_CH4)!, Add solder bridge for PG12 (TIM17_CH1)!
- Size
- Date
- A4
- Title
- Sheet number
- Author
- Revision

### Library data of the parts
CN?#8-CN?#11 = Pin-1x4: as CN?#3 on sheet Interface; Distributor: Mouser; Package: SMD 1.27mm
CN?#12 CN?#13 = Pin-1x6: 2.54mm; Part Class: Connector; Order Code: 855-M50-3530342; CompType: M50-3530342; Distributor: Mouser; Package: SMD 1.27mm
J?#2 = FTR-110-51-L-D-06: Connector; Manufacturer_Name: SAMTEC; Datasheet Link: http://suddendocs.samtec.com/catalog_english/ftr_smt.pdf; Manufacturer_Part_Number: FTR-110-51-L-D-06; Mouser Part Number: 200-FTR11051LD06; Mouser Price/Stock: https://www.mouser.co.uk/ProductDetail/Samtec/FTR-110-51-L-D-06?qs=PB6%2FjmICvI0RsXPabwmjvw%3D%3D; Arrow Part Number: FTR-110-51-L-D-06; Arrow Price/Stock: https://www.arrow.com/en/products/ftr-110-51-l-d-06/samtec?region=nac
U1 = NUCLEO-N657X0-Q: Reference: NUCLEO; Supplier: Tanszék; Name: NUCLEO-N657X0-Q

## Sheet Measurements.SchDoc
size A4; SheetNumber: 14; SheetTotal: 15
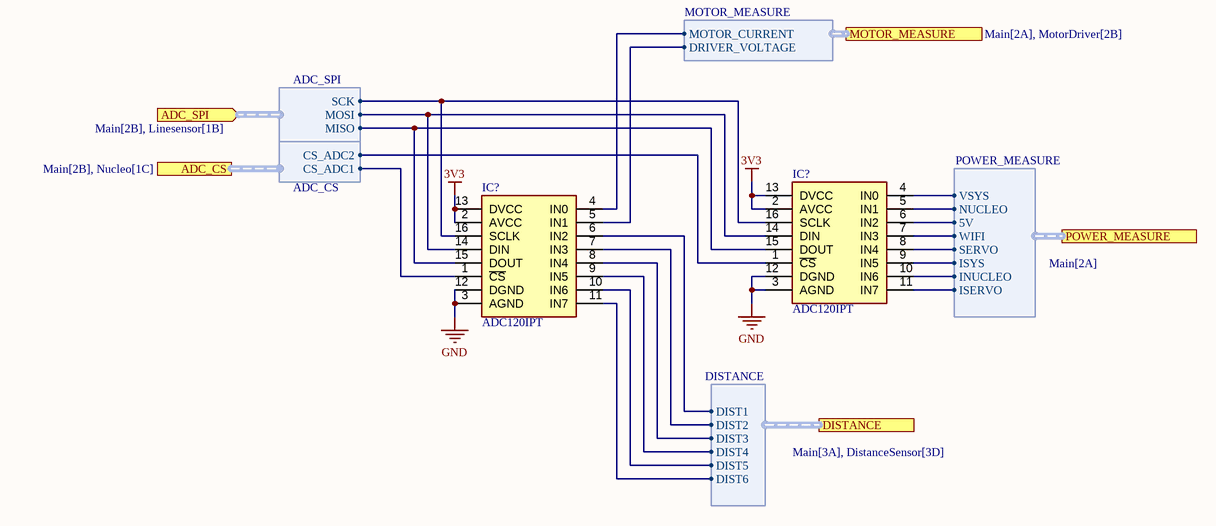
[diagram p7: Measurements.SchDoc]

### Parts
(Parts that share a designator on the sheet are numbered #1, #2 ... from top to bottom, then left to right.)
IC?#1  ADC120IPT  [TSSOP-16]
IC?#2  ADC120IPT  [TSSOP-16]

### Ports
ADC_CS (harness ADC_CS, see Main[2B], Nucleo[1C]), ADC_SPI (in, harness ADC_SPI, see Main[2B], Linesensor[1B]), DISTANCE (harness DISTANCE, see Main[3A], DistanceSensor[3D]), MOTOR_MEASURE (harness MOTOR_MEASURE, see Main[2A], MotorDriver[2B]), POWER_MEASURE (harness POWER_MEASURE, see Main[2A])

### Harnesses
DISTANCE: DIST1, DIST2, DIST3, DIST4, DIST5, DIST6
MOTOR_MEASURE: MOTOR_CURRENT, DRIVER_VOLTAGE
ADC_SPI: MOSI, MISO, SCK
ADC_CS: CS_ADC2, CS_ADC1
POWER_MEASURE: VSYS, NUCLEO, 5V, WIFI, SERVO, ISYS, INUCLEO, ISERVO

### Nets
3V3: IC?#1.2(AVCC) IC?#1.13(DVCC) IC?#2.2(AVCC) IC?#2.13(DVCC)
GND: IC?#1.3(AGND) IC?#1.12(DGND) IC?#2.3(AGND) IC?#2.12(DGND)
CONN_AD_MISO: IC?#1.15(DOUT) IC?#2.15(DOUT) ; port ADC_SPI.MISO
CONN_AD_MOSI: IC?#1.14(DIN) IC?#2.14(DIN) ; port ADC_SPI.MOSI
CONN_AD_SCK: IC?#1.16(SCLK) IC?#2.16(SCLK) ; port ADC_SPI.SCK
NetC?#51_2: IC?#2.9(IN5) ; port DISTANCE.DIST4
NetC?#52_2: IC?#2.8(IN4) ; port DISTANCE.DIST3
NetC?#53_2: IC?#2.10(IN6) ; port DISTANCE.DIST5
NetC?#54_2: IC?#2.7(IN3) ; port DISTANCE.DIST2
NetC?#55_2: IC?#2.11(IN7) ; port DISTANCE.DIST6
NetC?#56_2: IC?#2.6(IN2) ; port DISTANCE.DIST1
NetCN?#21_2: IC?#2.4(IN0) ; port MOTOR_MEASURE.MOTOR_CURRENT
NetCN?#21_3: IC?#2.5(IN1) ; port MOTOR_MEASURE.DRIVER_VOLTAGE
NetIC?#1_1: IC?#1.1(~{CS}) ; port ADC_CS.CS_ADC2
NetIC?#1_4: IC?#1.4(IN0) ; port POWER_MEASURE.VSYS
NetIC?#1_5: IC?#1.5(IN1) ; port POWER_MEASURE.NUCLEO
NetIC?#1_6: IC?#1.6(IN2) ; port POWER_MEASURE.5V
NetIC?#1_7: IC?#1.7(IN3) ; port POWER_MEASURE.WIFI
NetIC?#1_8: IC?#1.8(IN4) ; port POWER_MEASURE.SERVO
NetIC?#1_9: IC?#1.9(IN5) ; port POWER_MEASURE.ISYS
NetIC?#1_10: IC?#1.10(IN6) ; port POWER_MEASURE.INUCLEO
NetIC?#1_11: IC?#1.11(IN7) ; port POWER_MEASURE.ISERVO
NetIC?#2_1: IC?#2.1(~{CS}) ; port ADC_CS.CS_ADC1

### Notes on the sheet
- Size
- Date
- A4
- Title
- Sheet number
- Author
- Revision

### Library data of the parts
IC?#1 IC?#2 = ADC120IPT: Integrated Circuit; Manufacturer_Name: STMicroelectronics; Datasheet Link: https://www.st.com/resource/en/datasheet/adc120.pdf; Height: 1.2mm; Manufacturer_Part_Number: ADC120IPT; Mouser Part Number: 511-ADC120IPT; Mouser Price/Stock: https://www.mouser.co.uk/ProductDetail/STMicroelectronics/ADC120IPT?qs=PzGy0jfpSMuHQWzRzzPRMw%3D%3D; Arrow Part Number: ADC120IPT; Arrow Price/Stock: https://www.arrow.com/en/products/adc120ipt/stmicroelectronics?region=nac

## Sheet Power.SchDoc
size A3; SheetNumber: 4; SheetTotal: 15
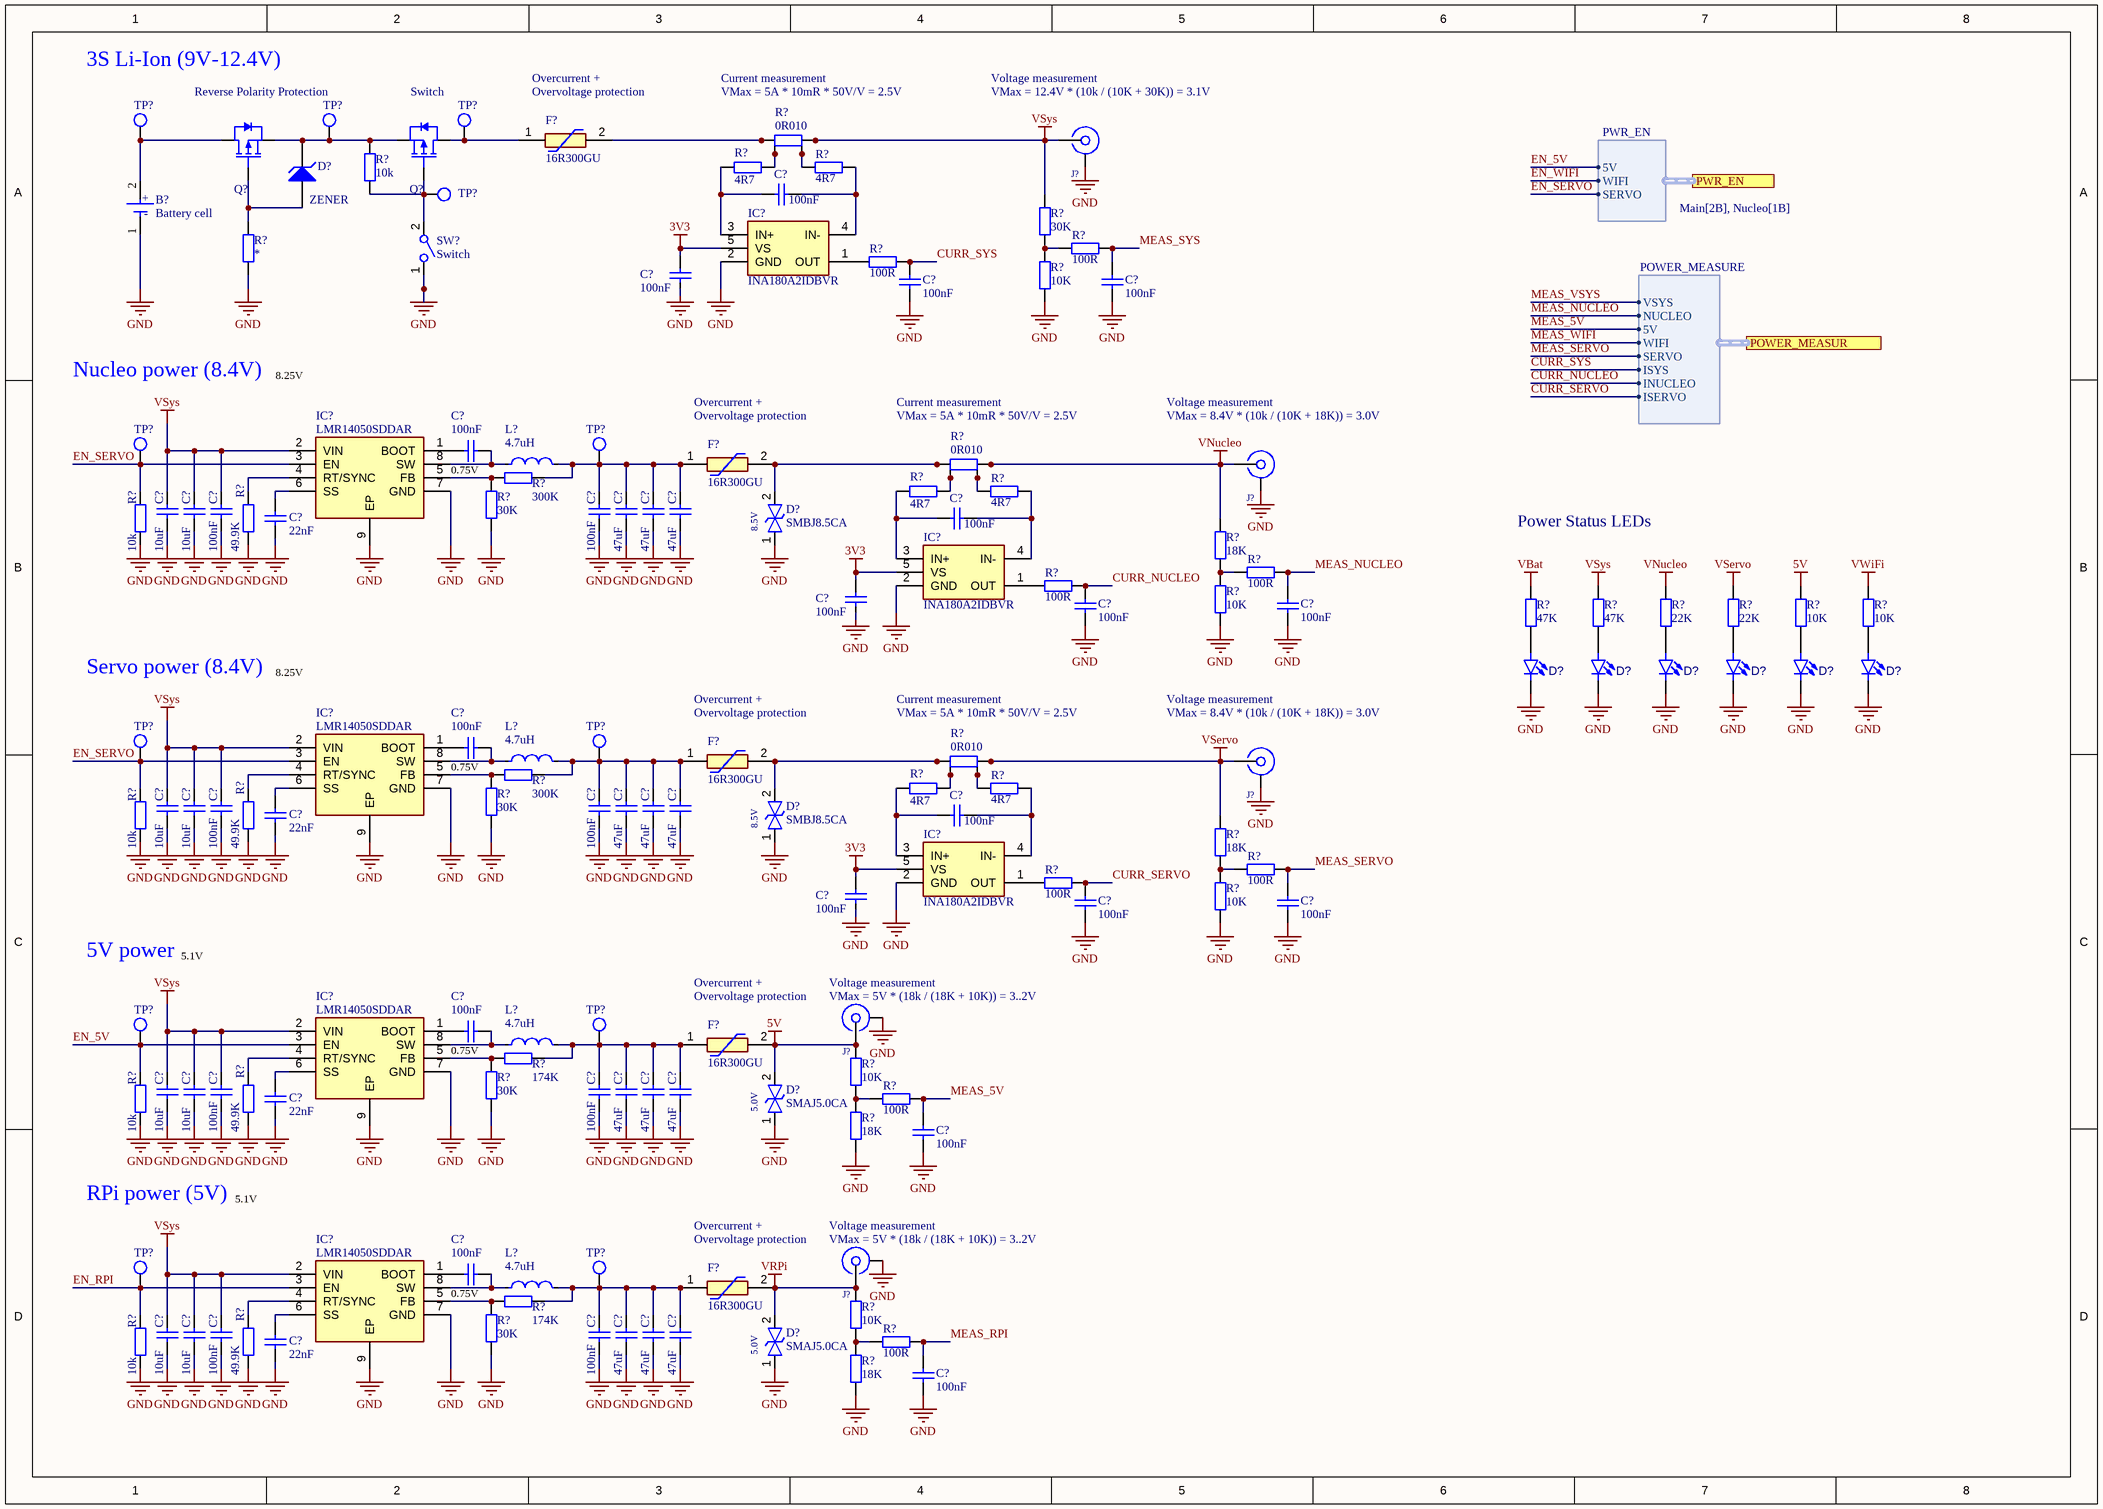
[diagram p8: Power.SchDoc]

### Parts
(Parts that share a designator on the sheet are numbered #1, #2 ... from top to bottom, then left to right.)
B?  Battery cell  [Single battery cell holder]
C?#1  100nF  [CAP0603]
C?#2  100nF  [CAP0603]
C?#3  100nF  [CAP0603]
C?#4  100nF  [CAP0603]
C?#5  100nF  [CAP0603]
C?#6  47uF  [CAP0603]
C?#7  47uF  [CAP0603]
C?#8  47uF  [CAP0603]
C?#9  100nF  [CAP0603]
C?#10  10uF  [CAP0603]
C?#11  10uF  [CAP0603]
C?#12  100nF  [CAP0603]
C?#13  100nF  [CAP0603]
C?#14  22nF  [CAP0603]
C?#15  100nF  [CAP0603]
C?#16  100nF  [CAP0603]
C?#17  100nF  [CAP0603]
C?#18  100nF  [CAP0603]
C?#19  47uF  [CAP0603]
C?#20  47uF  [CAP0603]
C?#21  47uF  [CAP0603]
C?#22  100nF  [CAP0603]
C?#23  10uF  [CAP0603]
C?#24  10uF  [CAP0603]
C?#25  100nF  [CAP0603]
C?#26  100nF  [CAP0603]
C?#27  22nF  [CAP0603]
C?#28  100nF  [CAP0603]
C?#29  100nF  [CAP0603]
C?#30  100nF  [CAP0603]
C?#31  100nF  [CAP0603]
C?#32  47uF  [CAP0603]
C?#33  47uF  [CAP0603]
C?#34  47uF  [CAP0603]
C?#35  10uF  [CAP0603]
C?#36  10uF  [CAP0603]
C?#37  100nF  [CAP0603]
C?#38  100nF  [CAP0603]
C?#39  22nF  [CAP0603]
C?#40  100nF  [CAP0603]
C?#41  100nF  [CAP0603]
C?#42  47uF  [CAP0603]
C?#43  47uF  [CAP0603]
C?#44  47uF  [CAP0603]
C?#45  10uF  [CAP0603]
C?#46  10uF  [CAP0603]
C?#47  100nF  [CAP0603]
C?#48  100nF  [CAP0603]
C?#49  22nF  [CAP0603]
C?#50  100nF  [CAP0603]
D?#1  ZENER  [FP_SMA]
D?#2  SMBJ8.5CA  [SMB_BI]
D?#3  (no value)  [LED0603]
D?#4  (no value)  [LED0603]
D?#5  (no value)  [LED0603]
D?#6  (no value)  [LED0603]
D?#7  (no value)  [LED0603]
D?#8  (no value)  [LED0603]
D?#9  SMBJ8.5CA  [SMB_BI]
D?#10  SMAJ5.0CA  [SMA_BI]
D?#11  SMAJ5.0CA  [SMA_BI]
F?#1  16R300GU  [Polyfuse]
F?#2  16R300GU  [Polyfuse]
F?#3  16R300GU  [Polyfuse]
F?#4  16R300GU  [Polyfuse]
F?#5  16R300GU  [Polyfuse]
IC?#3  INA180A2IDBVR  [SOT23-5]
IC?#4  LMR14050SDDAR  [SOIC-8-TP]
IC?#5  INA180A2IDBVR  [SOT23-5]
IC?#6  LMR14050SDDAR  [SOIC-8-TP]
IC?#7  INA180A2IDBVR  [SOT23-5]
IC?#8  LMR14050SDDAR  [SOIC-8-TP]
IC?#9  LMR14050SDDAR  [SOIC-8-TP]
J?#3  UFL  [UFL]  (value not drawn)
J?#4  UFL  [UFL]  (value not drawn)
J?#5  UFL  [UFL]  (value not drawn)
J?#6  UFL  [UFL]  (value not drawn)
J?#7  UFL  [UFL]  (value not drawn)
L?#2  4.7uH
L?#3  4.7uH
L?#4  4.7uH
L?#5  4.7uH
Q?#2  P-MOSFET  (value not drawn)
Q?#3  P-MOSFET  (value not drawn)
R?#2  10k  [RES0603]
R?#3  0R010  [RES1206_KELVIN]
R?#4  4R7  [RES0603]
R?#5  4R7  [RES0603]
R?#6  30K  [RES0603]
R?#7  100R  [RES0603]
R?#8  100R  [RES0603]
R?#9  *  [RES0603]
R?#10  10K  [RES0603]
R?#11  0R010  [RES1206_KELVIN]
R?#12  300K  [RES0603]
R?#13  4R7  [RES0603]
R?#14  4R7  [RES0603]
R?#15  18K  [RES0603]
R?#16  30K  [RES0603]
R?#17  10k  [RES0603]
R?#18  49.9K  [RES0603]
R?#19  100R  [RES0603]
R?#20  100R  [RES0603]
R?#21  10K  [RES0603]
R?#22  47K  [RES0603]
R?#23  47K  [RES0603]
R?#24  22K  [RES0603]
R?#25  22K  [RES0603]
R?#26  10K  [RES0603]
R?#27  10K  [RES0603]
R?#28  0R010  [RES1206_KELVIN]
R?#29  300K  [RES0603]
R?#30  4R7  [RES0603]
R?#31  4R7  [RES0603]
R?#32  18K  [RES0603]
R?#33  30K  [RES0603]
R?#34  10k  [RES0603]
R?#35  49.9K  [RES0603]
R?#36  100R  [RES0603]
R?#37  100R  [RES0603]
R?#38  10K  [RES0603]
R?#39  174K  [RES0603]
R?#40  10K  [RES0603]
R?#41  100R  [RES0603]
R?#42  30K  [RES0603]
R?#43  10k  [RES0603]
R?#44  49.9K  [RES0603]
R?#45  18K  [RES0603]
R?#46  174K  [RES0603]
R?#47  10K  [RES0603]
R?#48  100R  [RES0603]
R?#49  30K  [RES0603]
R?#50  10k  [RES0603]
R?#51  49.9K  [RES0603]
R?#52  18K  [RES0603]
SW?  Switch
TP?#1  Test Point  [TP_1.5HOLE]  (value not drawn)
TP?#2  Test Point  [TP_1.5HOLE]  (value not drawn)
TP?#3  Test Point  [TP_1.5HOLE]  (value not drawn)
TP?#4  Test Point  [TP_1.5HOLE]  (value not drawn)
TP?#5  Test Point  [TP_1.5HOLE]  (value not drawn)
TP?#6  Test Point  [TP_1.5HOLE]  (value not drawn)
TP?#7  Test Point  [TP_1.5HOLE]  (value not drawn)
TP?#8  Test Point  [TP_1.5HOLE]  (value not drawn)
TP?#9  Test Point  [TP_1.5HOLE]  (value not drawn)
TP?#10  Test Point  [TP_1.5HOLE]  (value not drawn)
TP?#11  Test Point  [TP_1.5HOLE]  (value not drawn)
TP?#12  Test Point  [TP_1.5HOLE]  (value not drawn)

### Ports
POWER_MEASUR (harness POWER_MEASURE), PWR_EN (harness PWR_EN, see Main[2B], Nucleo[1B])

### Harnesses
POWER_MEASURE: VSYS, NUCLEO, 5V, WIFI, SERVO, ISYS, INUCLEO, ISERVO
PWR_EN: 5V, WIFI, SERVO

### Nets
3V3: C?#2.2 C?#15.2 C?#28.2 IC?#3.5(VS) IC?#5.5(VS) IC?#7.5(VS)
5V: D?#10.2 F?#4.2 J?#6.1 R?#26.2 R?#40.2
GND: B?.1(C) C?#2.1 C?#3.1 C?#4.1 C?#6.2 C?#7.2 C?#8.2 C?#10.1 C?#11.1 C?#12.1 C?#13.1 C?#14.1 C?#15.1 C?#16.1 C?#17.1 C?#19.2 C?#20.2 C?#21.2 C?#23.1 C?#24.1 C?#25.1 C?#26.1 C?#27.1 C?#28.1 C?#29.1 C?#30.1 C?#32.2 C?#33.2 C?#34.2 C?#35.1 C?#36.1 C?#37.1 C?#38.1 C?#39.1 C?#40.1 C?#42.2 C?#43.2 C?#44.2 C?#45.1 C?#46.1 C?#47.1 C?#48.1 C?#49.1 C?#50.1 D?#2.1 D?#3.1(K) D?#4.1(K) D?#5.1(K) D?#6.1(K) D?#7.1(K) D?#8.1(K) D?#9.1 D?#10.1 D?#11.1 IC?#3.2(GND) IC?#4.7(GND) IC?#4.9(EP) IC?#5.2(GND) IC?#6.7(GND) IC?#6.9(EP) IC?#7.2(GND) IC?#8.7(GND) IC?#8.9(EP) IC?#9.7(GND) IC?#9.9(EP) J?#3.2 J?#4.2 J?#5.2 J?#6.2 J?#7.2 R?#9.1 R?#10.1 R?#16.1 R?#17.1 R?#18.1 R?#21.1 R?#33.1 R?#34.1 R?#35.1 R?#38.1 R?#42.1 R?#43.1 R?#44.1 R?#45.1 R?#49.1 R?#50.1 R?#51.1 R?#52.1 SW?.1
VBat: R?#22.2
VNucleo: J?#4.1 R?#11.2 R?#15.1 R?#24.2
VRPi: D?#11.2 F?#5.2 J?#7.1 R?#47.2
VServo: J?#5.1 R?#25.2 R?#28.2 R?#32.1
VSys: C?#10.2 C?#11.2 C?#12.2 C?#23.2 C?#24.2 C?#25.2 C?#35.2 C?#36.2 C?#37.2 C?#45.2 C?#46.2 C?#47.2 IC?#4.2(VIN) IC?#6.2(VIN) IC?#8.2(VIN) IC?#9.2(VIN) J?#3.1 R?#3.2 R?#6.2 R?#23.2
VWiFi: R?#27.2
CURR_NUCLEO: C?#16.2 R?#20.2 ; port POWER_MEASUR.INUCLEO
CURR_SERVO: C?#29.2 R?#37.2 ; port POWER_MEASUR.ISERVO
CURR_SYS: C?#3.2 R?#8.2 ; port POWER_MEASUR.ISYS
EN_5V: IC?#8.3(EN) R?#43.2 TP?#9.1 ; port PWR_EN.5V
EN_RPI: IC?#9.3(EN) R?#50.2 TP?#11.1
EN_SERVO: IC?#4.3(EN) IC?#6.3(EN) R?#17.2 R?#34.2 TP?#5.1 TP?#7.1 ; port PWR_EN.SERVO
EN_WIFI: port PWR_EN.WIFI
MEAS_5V: C?#40.2 R?#41.2 ; port POWER_MEASUR.5V
MEAS_NUCLEO: C?#17.2 R?#19.2 ; port POWER_MEASUR.NUCLEO
MEAS_RPI: C?#50.2 R?#48.2
MEAS_SERVO: C?#30.2 R?#36.2 ; port POWER_MEASUR.SERVO
MEAS_SYS: C?#4.2 R?#7.2
MEAS_VSYS: port POWER_MEASUR.VSYS
MEAS_WIFI: port POWER_MEASUR.WIFI
NetB?_2: B?.2(A) Q?#2.3(D) TP?#1.1
NetC?#1_1: C?#1.1 IC?#3.4(IN-) R?#5.1
NetC?#1_2: C?#1.2 IC?#3.3(IN+) R?#4.2
NetC?#5_1: C?#5.1 IC?#4.1(BOOT)
NetC?#5_2: C?#5.2 IC?#4.8(SW) L?#2.1
NetC?#6_1: C?#6.1 C?#7.1 C?#8.1 C?#13.2 F?#2.1 L?#2.2 R?#12.1 TP?#6.1
NetC?#9_1: C?#9.1 IC?#5.4(IN-) R?#14.1
NetC?#9_2: C?#9.2 IC?#5.3(IN+) R?#13.2
NetC?#14_2: C?#14.2 IC?#4.6(SS)
NetC?#18_1: C?#18.1 IC?#6.1(BOOT)
NetC?#18_2: C?#18.2 IC?#6.8(SW) L?#3.1
NetC?#19_1: C?#19.1 C?#20.1 C?#21.1 C?#26.2 F?#3.1 L?#3.2 R?#29.1 TP?#8.1
NetC?#22_1: C?#22.1 IC?#7.4(IN-) R?#31.1
NetC?#22_2: C?#22.2 IC?#7.3(IN+) R?#30.2
NetC?#27_2: C?#27.2 IC?#6.6(SS)
NetC?#31_1: C?#31.1 IC?#8.1(BOOT)
NetC?#31_2: C?#31.2 IC?#8.8(SW) L?#4.1
NetC?#32_1: C?#32.1 C?#33.1 C?#34.1 C?#38.2 F?#4.1 L?#4.2 R?#39.1 TP?#10.1
NetC?#39_2: C?#39.2 IC?#8.6(SS)
NetC?#41_1: C?#41.1 IC?#9.1(BOOT)
NetC?#41_2: C?#41.2 IC?#9.8(SW) L?#5.1
NetC?#42_1: C?#42.1 C?#43.1 C?#44.1 C?#48.2 F?#5.1 L?#5.2 R?#46.1 TP?#12.1
NetC?#49_2: C?#49.2 IC?#9.6(SS)
NetD?#1_1: D?#1.1(A) Q?#2.1(G) R?#9.2
NetD?#1_2: D?#1.2(K) Q?#2.2(S) Q?#3.2(S) R?#2.1 TP?#2.1
NetD?#2_2: D?#2.2 F?#2.2 R?#11.1
NetD?#3_2: D?#3.2(A) R?#22.1
NetD?#4_2: D?#4.2(A) R?#23.1
NetD?#5_2: D?#5.2(A) R?#24.1
NetD?#6_2: D?#6.2(A) R?#25.1
NetD?#7_2: D?#7.2(A) R?#26.1
NetD?#8_2: D?#8.2(A) R?#27.1
NetD?#9_2: D?#9.2 F?#3.2 R?#28.1
NetF?#1_1: F?#1.1 Q?#3.3(D) TP?#3.1
NetF?#1_2: F?#1.2 R?#3.1
NetIC?#3_1: IC?#3.1(OUT) R?#8.1
NetIC?#4_4: IC?#4.4(RT/SYNC) R?#18.2
NetIC?#4_5: IC?#4.5(FB) R?#12.2 R?#16.2
NetIC?#5_1: IC?#5.1(OUT) R?#20.1
NetIC?#6_4: IC?#6.4(RT/SYNC) R?#35.2
NetIC?#6_5: IC?#6.5(FB) R?#29.2 R?#33.2
NetIC?#7_1: IC?#7.1(OUT) R?#37.1
NetIC?#8_4: IC?#8.4(RT/SYNC) R?#44.2
NetIC?#8_5: IC?#8.5(FB) R?#39.2 R?#42.2
NetIC?#9_4: IC?#9.4(RT/SYNC) R?#51.2
NetIC?#9_5: IC?#9.5(FB) R?#46.2 R?#49.2
NetQ?#3_1: Q?#3.1(G) R?#2.2 SW?.2 TP?#4.1
NetR?#3_3: R?#3.3 R?#4.1
NetR?#3_4: R?#3.4 R?#5.2
NetR?#6_1: R?#6.1 R?#7.1 R?#10.2
NetR?#11_3: R?#11.3 R?#13.1
NetR?#11_4: R?#11.4 R?#14.2
NetR?#15_2: R?#15.2 R?#19.1 R?#21.2
NetR?#28_3: R?#28.3 R?#30.1
NetR?#28_4: R?#28.4 R?#31.2
NetR?#32_2: R?#32.2 R?#36.1 R?#38.2
NetR?#40_1: R?#40.1 R?#41.1 R?#45.2
NetR?#47_1: R?#47.1 R?#48.1 R?#52.2

### Notes on the sheet
- 3S Li-Ion (9V-12.4V)
- Reverse Polarity Protection
- Switch
- Overcurrent +
- (near F?#1) Overvoltage protection
- Current measurement
- (near R?#3) VMax = 5A * 10mR * 50V/V = 2.5V
- Voltage measurement
- (near J?#3) VMax = 12.4V * (10k / (10K + 30K)) = 3.1V
- Nucleo power (8.4V)
- 8.25V
- (near F?#2) Overvoltage protection
- (near R?#11) VMax = 5A * 10mR * 50V/V = 2.5V
- (near J?#4) VMax = 8.4V * (10k / (10K + 18K)) = 3.0V
- 0.75V
- Power Status LEDs
- Servo power (8.4V)
- (near F?#3) Overvoltage protection
- (near R?#28) VMax = 5A * 10mR * 50V/V = 2.5V
- (near J?#5) VMax = 8.4V * (10k / (10K + 18K)) = 3.0V
- 5V power
- 5.1V
- (near J?#6) Voltage measurement
- Overvoltage protection
- (near J?#6) VMax = 5V * (18k / (18K + 10K)) = 3..2V
- RPi power (5V)
- (near J?#7) VMax = 5V * (18k / (18K + 10K)) = 3..2V
- (near J?#7) Voltage measurement
- Size
- Date
- A3
- Title
- Sheet number
- Author
- Revision
- (in symbol Battery cell) +; -

### Library data of the parts
C?#1-C?#50 = Capacitor: Voltage: *
  C?#1-C?#5 C?#9 C?#12 C?#13 C?#15-C?#18 C?#22 C?#25 C?#26 C?#28-C?#31 C?#37 C?#38 C?#40 C?#41 C?#47 C?#48 C?#50: Value: 100nF
  C?#6-C?#8 C?#19-C?#21 C?#32-C?#34 C?#42-C?#44: Value: 47uF
  C?#10 C?#11 C?#23 C?#24 C?#35 C?#36 C?#45 C?#46: Value: 10uF
  C?#14 C?#27 C?#39 C?#49: Value: 22nF
D?#1 = ZENER: Zener Diode; U_Z: 24
D?#2 D?#9 = SMBJ8.5CA: 41.8A 600W 14.5V 9.44V Bidirectional 8.6V DO-214AA(SMB) TVS Diodes ROHS; Manufacturer_Name: GOODWORK; Vrwm: 8.5V; Breakdown voltage: 10V; Clamping voltage: 14.4V; Manufacturer_Part_Number: SMBJ8.5CA; Mouser Part Number: *; LCSC Part Number: C33127061
D?#3-D?#8 = LED: Light Emitting Diode
D?#10 D?#11 = SMAJ5.0CA: 43.5A 400W 9.2V 6.4V Bidirectional 5V DO-214AC(SMA) TVS Diodes ROHS; Manufacturer_Name: GOODWORK; Vrwm: 5.0V; Manufacturer_Part_Number: SMAJ5.0CA; Mouser Part Number: *; LCSC Part Number: C908809; Breakdown voltage: 6.4V; Clamping voltage: 9.2V
F?#1-F?#5 = 16R300GU: Fuse; Manufacturer_Name: LITTELFUSE; Datasheet Link: https://componentsearchengine.com/Datasheets/2/16R300GU.pdf; Height: 11mm; Manufacturer_Part_Number: 16R300GU; Mouser Part Number: 576-16R300GU; Mouser Price/Stock: https://www.mouser.co.uk/ProductDetail/Littelfuse/16R300GU?qs=ZSIFh4sPSRouCQaFuDECOQ%3D%3D; Arrow Part Number: 16R300GU; Arrow Price/Stock: https://www.arrow.com/en/products/16r300gu/littelfuse?region=europe
IC?#3 IC?#5 IC?#7 = INA180A2IDBVR: Integrated Circuit; Manufacturer_Name: Texas Instruments; Datasheet Link: http://www.ti.com/lit/ds/symlink/ina180.pdf; Height: 1.45mm; Manufacturer_Part_Number: INA180A2IDBVR; Mouser Part Number: 595-INA180A2IDBVR; Mouser Price/Stock: https://www.mouser.co.uk/ProductDetail/Texas-Instruments/INA180A2IDBVR?qs=5aG0NVq1C4wYcJfa99BoHg%3D%3D; Arrow Part Number: INA180A2IDBVR; Arrow Price/Stock: https://www.arrow.com/en/products/ina180a2idbvr/texas-instruments?utm_currency=USD&region=nac; LCSC Part Number: C192764
IC?#4 IC?#6 IC?#8 IC?#9 = LMR14050SDDAR: Integrated Circuit; Manufacturer_Name: Texas Instruments; Datasheet Link: http://www.ti.com/lit/gpn/lmr14050; Height: 1.7mm; Manufacturer_Part_Number: LMR14050SDDAR; Mouser Part Number: 595-LMR14050SDDAR; Mouser Price/Stock: https://www.mouser.co.uk/ProductDetail/Texas-Instruments/LMR14050SDDAR?qs=G5PZsBocSXuzvyUQdQ5q2Q%3D%3D; Arrow Part Number: LMR14050SDDAR; Arrow Price/Stock: https://www.arrow.com/en/products/lmr14050sddar/texas-instruments?utm_currency=USD&region=nac
L?#2-L?#5 = Inductor: Value: 4.7uH
Q?#2 Q?#3 = P-MOSFET: P channel MOSFET
R?#2 R?#4-R?#10 R?#12-R?#27 R?#29-R?#52 = Resistor
  R?#2 R?#17 R?#34 R?#43 R?#50: Value: 10k
  R?#4 R?#5 R?#13 R?#14 R?#30 R?#31: Value: 4R7
  R?#6 R?#16 R?#33 R?#42 R?#49: Value: 30K
  R?#7 R?#8 R?#19 R?#20 R?#36 R?#37 R?#41 R?#48: Value: 100R
  R?#9: Value: *
  R?#10 R?#21 R?#26 R?#27 R?#38 R?#40 R?#47: Value: 10K
  R?#12 R?#29: Value: 300K; LCSC Part Number: C23024
  R?#15 R?#32 R?#45 R?#52: Value: 18K
  R?#18 R?#35 R?#44 R?#51: Value: 49.9K
  R?#22 R?#23: Value: 47K
  R?#24 R?#25: Value: 22K
  R?#39 R?#46: Value: 174K; LCSC Part Number: C22890
R?#3 R?#11 R?#28 = 0R010: Resistor Current Sense Metal Foil 1206 10m Ohm 1% 1W ±50ppm/°C T/R; Manufacturer: Eaton; Manufacturer Part Number: MFSA1206R0050FCM; Supplier Part Number: 504-MFSA1206R0050FCM; RoHS: No; Category: Chip SMD Resistors; Stock: 9199; Pricing: 1=0.21, 10=0.173, 50=0.173, 100=0.128, 1000=0.096, 10000=0.062 (USD); Temperature Coefficient: 50ppm/°C; Value: 0R010

## Sheet Encoder.SchDoc
size A4; SheetNumber: 7; SheetTotal: 15
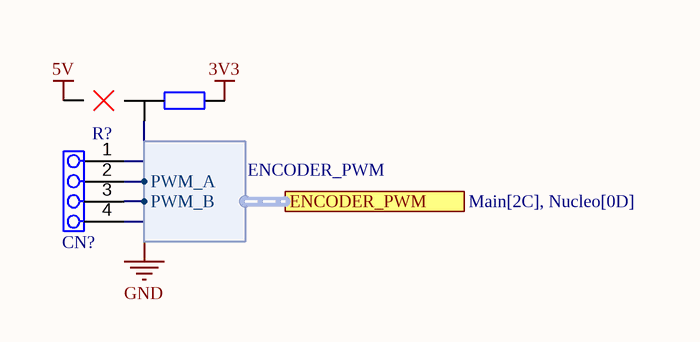
[diagram p9: Encoder.SchDoc]

### Parts
(Parts that share a designator on the sheet are numbered #1, #2 ... from top to bottom, then left to right.)
CN?#14  Pins 1x3  [PIN-1X4]  (value not drawn)
R?#53  *  [RES0603 _SELECTION]  (value not drawn)

### Ports
ENCODER_PWM (harness ENCODER_PWM, see Main[2C], Nucleo[0D])

### Harnesses
ENCODER_PWM: PWM_A, PWM_B

### Nets
3V3: R?#53.1
5V: R?#53.3
GND: CN?#14.4
TIM4_CH2: CN?#14.3 ; port ENCODER_PWM.PWM_B
NetCN?#14_1: CN?#14.1 R?#53.2
NetCN?#14_2: CN?#14.2 ; port ENCODER_PWM.PWM_A

### Notes on the sheet
- Size
- Date
- A4
- Title
- Sheet number
- Author
- Revision

### Library data of the parts
CN?#14 = Pin-1x4: as CN?#3 on sheet Interface; Distributor: Mouser; Package: SMD 1.27mm
R?#53 = Resistor_Selection: Resistor; Value: *

## Sheet Servo.SchDoc
size A4; SheetNumber: 10; SheetTotal: 15
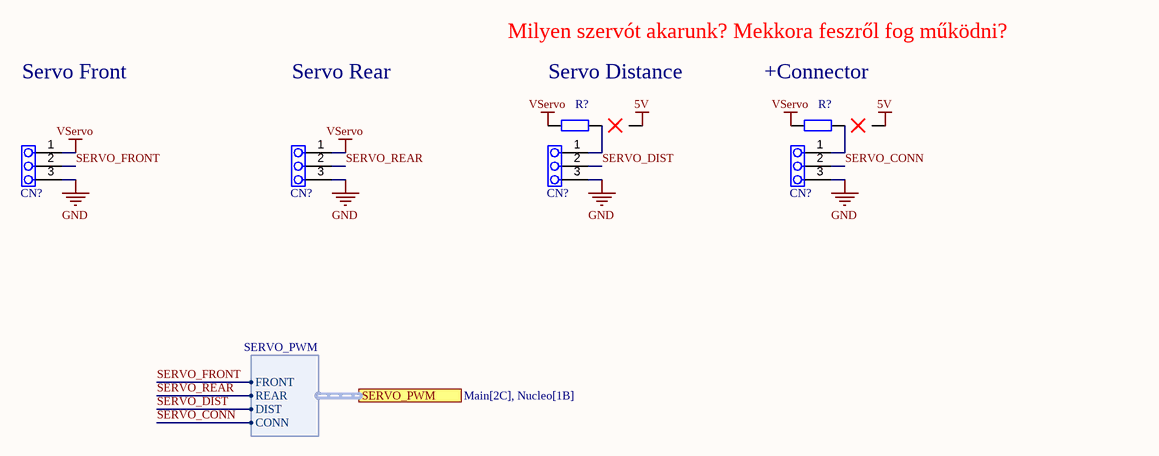
[diagram p10: Servo.SchDoc]

### Parts
(Parts that share a designator on the sheet are numbered #1, #2 ... from top to bottom, then left to right.)
CN?#15  Pins 1x3  [PIN-1X3]  (value not drawn)
CN?#16  Pins 1x3  [PIN-1X3]  (value not drawn)
CN?#17  Pins 1x3  [PIN-1X3]  (value not drawn)
CN?#18  Pins 1x3  [PIN-1X3]  (value not drawn)
R?#54  *  [RES0603 _SELECTION]  (value not drawn)
R?#55  *  [RES0603 _SELECTION]  (value not drawn)

### Ports
SERVO_PWM (harness SERVO_PWM, see Main[2C], Nucleo[1B])

### Harnesses
SERVO_PWM: REAR, FRONT, DIST, CONN

### Nets
5V: R?#54.3 R?#55.3
GND: CN?#15.3 CN?#16.3 CN?#17.3 CN?#18.3
VServo: CN?#15.1 CN?#16.1 R?#54.1 R?#55.1
SERVO_CONN: CN?#18.2 ; port SERVO_PWM.CONN
SERVO_DIST: CN?#17.2 ; port SERVO_PWM.DIST
SERVO_FRONT: CN?#15.2 ; port SERVO_PWM.FRONT
SERVO_REAR: CN?#16.2 ; port SERVO_PWM.REAR
NetCN?#17_1: CN?#17.1 R?#54.2
NetCN?#18_1: CN?#18.1 R?#55.2

### Notes on the sheet
- Milyen szervót akarunk? Mekkora feszről fog működni?
- Servo Front
- Servo Rear
- (near R?#54) Servo Distance
- (near R?#55) +Connector
- Size
- Date
- A4
- Title
- Sheet number
- Author
- Revision

### Library data of the parts
CN?#15-CN?#18 = Pins 1x3: 1x3 2.54mm; Part Class: Connector; Order Code: 855-M50-3530342; CompType: M50-3530342; Distributor: Mouser; Package: SMD 1.27mm
R?#54 R?#55 = Resistor_Selection: Resistor; Value: *

## Sheet MotorDriver.SchDoc
size A4; SheetNumber: 9; SheetTotal: 15
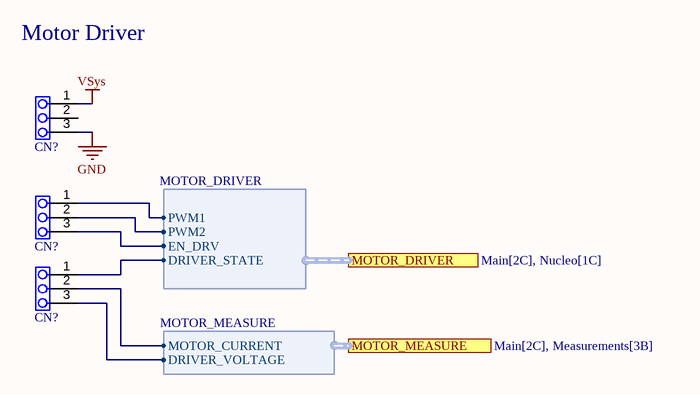
[diagram p11: MotorDriver.SchDoc]

### Parts
(Parts that share a designator on the sheet are numbered #1, #2 ... from top to bottom, then left to right.)
CN?#19  Pins 1x3  [PIN-1X3]  (value not drawn)
CN?#20  Pins 1x3  [PIN-1X3]  (value not drawn)
CN?#21  Pins 1x3  [PIN-1X3]  (value not drawn)

### Ports
MOTOR_DRIVER (harness MOTOR_DRIVER, see Main[2C], Nucleo[1C]), MOTOR_MEASURE (harness MOTOR_MEASURE, see Main[2C], Measurements[3B])

### Harnesses
MOTOR_DRIVER: PWM1, PWM2, EN_DRV, DRIVER_STATE
MOTOR_MEASURE: MOTOR_CURRENT, DRIVER_VOLTAGE

### Nets
GND: CN?#19.3
VSys: CN?#19.1
DRIVER_STATE: CN?#21.1 ; port MOTOR_DRIVER.DRIVER_STATE
EN_DRV: CN?#20.3 ; port MOTOR_DRIVER.EN_DRV
TIM3_CH3: CN?#20.1 ; port MOTOR_DRIVER.PWM1
TIM3_CH4: CN?#20.2 ; port MOTOR_DRIVER.PWM2
NetCN?#21_2: CN?#21.2 ; port MOTOR_MEASURE.MOTOR_CURRENT
NetCN?#21_3: CN?#21.3 ; port MOTOR_MEASURE.DRIVER_VOLTAGE

Not connected (* = marked no-connect by the designer): CN?#19 2

### Notes on the sheet
- Motor Driver
- Size
- Date
- A4
- Title
- Sheet number
- Author
- Revision

### Library data of the parts
CN?#19-CN?#21 = Pins 1x3: as CN?#15 on sheet Servo; Distributor: Mouser; Package: SMD 1.27mm

## Sheet Linesensor.SchDoc
size A4; SheetNumber: 6; SheetTotal: 15
Used 2 times, as channels U_Linesensor, U_Linesensor. Parts and nets are listed once, with the designators drawn on the sheet.
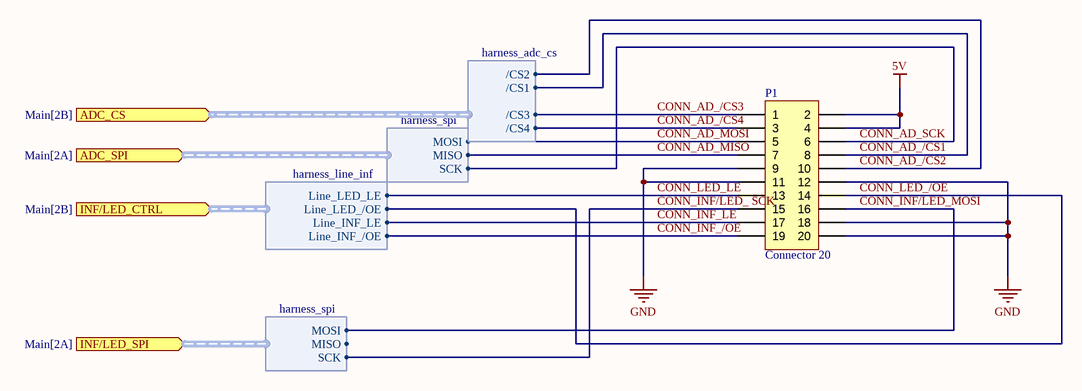
[diagram p12: Linesensor.SchDoc]

### Parts
P1  Connector 20  [CONNECTOR-20P]

### Ports
ADC_CS (in, harness harness_adc_cs, see Main[2B]), ADC_SPI (in, harness harness_spi, see Main[2A]), INF/LED_CTRL (in, harness harness_line_inf, see Main[2B]), INF/LED_SPI (in, harness harness_spi, see Main[2A])

### Harnesses
harness_line_inf: Line_LED_LE, Line_INF_LE, Line_INF_/OE, Line_LED_/OE
harness_spi: MOSI, MISO, SCK
harness_adc_cs: /CS2, /CS1, /CS3, /CS4

### Nets
5V: P1.2 P1.4
GND: P1.9 P1.11 P1.12 P1.18 P1.20
CONN_AD_/CS1: P1.8 ; port ADC_CS./CS1
CONN_AD_/CS2: P1.10 ; port ADC_CS./CS2
CONN_AD_/CS3: P1.1 ; port ADC_CS./CS3
CONN_AD_/CS4: P1.3 ; port ADC_CS./CS4
CONN_AD_MISO: P1.7 ; port ADC_SPI.MISO
CONN_AD_MOSI: P1.5 ; port ADC_SPI.MOSI
CONN_AD_SCK: P1.6 ; port ADC_SPI.SCK
CONN_INF/LED_ SCK: P1.15 ; port INF/LED_SPI.SCK
CONN_INF/LED_MOSI: P1.16 ; port INF/LED_SPI.MOSI
CONN_INF_/OE: P1.19 ; port INF/LED_CTRL.Line_INF_/OE
CONN_INF_LE: P1.17 ; port INF/LED_CTRL.Line_INF_LE
CONN_LED_/OE: P1.14 ; port INF/LED_CTRL.Line_LED_/OE
CONN_LED_LE: P1.13 ; port INF/LED_CTRL.Line_LED_LE

### Channels
U_Linesensor: designators end in _U_Linesensor#1
U_Linesensor: designators end in _U_Linesensor#2

### Notes on the sheet
- Size
- Date
- A4
- Title
- Sheet number
- Author
- Revision

### Library data of the parts
P1 = Connector 20: Ribbon cable connector; Name: SZAL.KABEL 20 P APA 90° BHR-20 (T-T); Reference: 43-01-11; Supplier: Lomex

## Sheet DistanceSensor.SchDoc
size A4; SheetNumber: 8; SheetTotal: 15
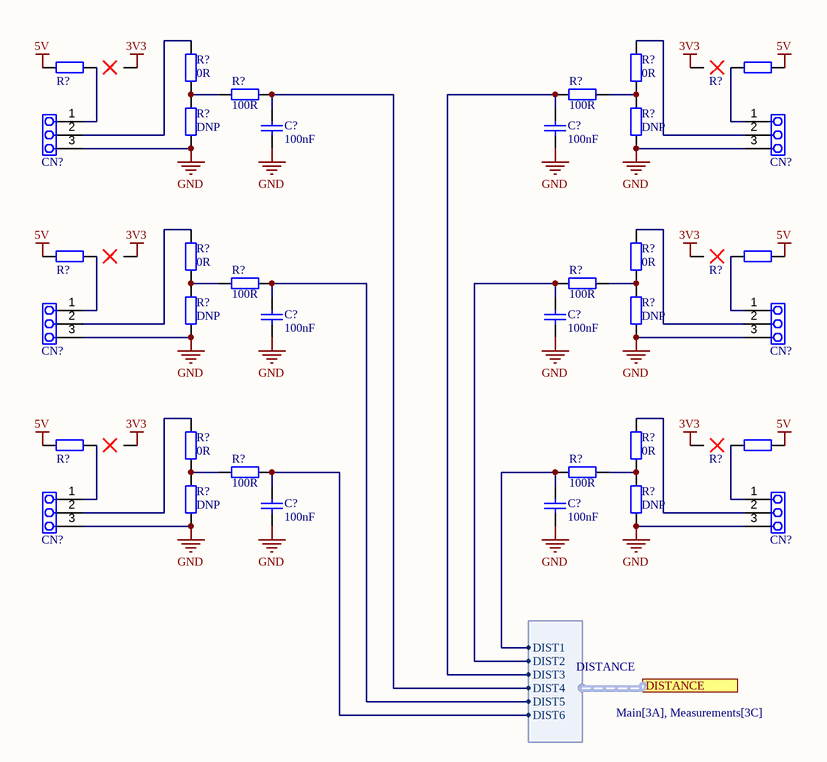
[diagram p13: DistanceSensor.SchDoc]

### Parts
(Parts that share a designator on the sheet are numbered #1, #2 ... from top to bottom, then left to right.)
C?#51  100nF  [CAP0603]
C?#52  100nF  [CAP0603]
C?#53  100nF  [CAP0603]
C?#54  100nF  [CAP0603]
C?#55  100nF  [CAP0603]
C?#56  100nF  [CAP0603]
CN?#22  Pins 1x3  [PIN-1X3]  (value not drawn)
CN?#23  Pins 1x3  [PIN-1X3]  (value not drawn)
CN?#24  Pins 1x3  [PIN-1X3]  (value not drawn)
CN?#25  Pins 1x3  [PIN-1X3]  (value not drawn)
CN?#26  Pins 1x3  [PIN-1X3]  (value not drawn)
CN?#27  Pins 1x3  [PIN-1X3]  (value not drawn)
R?#56  *  [RES0603 _SELECTION]  (value not drawn)
R?#57  *  [RES0603 _SELECTION]  (value not drawn)
R?#58  0R  [RES0603]
R?#59  100R  [RES0603]
R?#60  100R  [RES0603]
R?#61  0R  [RES0603]
R?#62  DNP  [RES0603]  (no BOM)
R?#63  DNP  [RES0603]  (no BOM)
R?#64  *  [RES0603 _SELECTION]  (value not drawn)
R?#65  *  [RES0603 _SELECTION]  (value not drawn)
R?#66  0R  [RES0603]
R?#67  100R  [RES0603]
R?#68  100R  [RES0603]
R?#69  0R  [RES0603]
R?#70  DNP  [RES0603]  (no BOM)
R?#71  DNP  [RES0603]  (no BOM)
R?#72  *  [RES0603 _SELECTION]  (value not drawn)
R?#73  *  [RES0603 _SELECTION]  (value not drawn)
R?#74  0R  [RES0603]
R?#75  100R  [RES0603]
R?#76  100R  [RES0603]
R?#77  0R  [RES0603]
R?#78  DNP  [RES0603]  (no BOM)
R?#79  DNP  [RES0603]  (no BOM)

### Ports
DISTANCE (harness DISTANCE, see Main[3A], Measurements[3C])

### Harnesses
DISTANCE: DIST1, DIST2, DIST3, DIST4, DIST5, DIST6

### Nets
3V3: R?#56.3 R?#57.3 R?#64.3 R?#65.3 R?#72.3 R?#73.3
5V: R?#56.1 R?#57.1 R?#64.1 R?#65.1 R?#72.1 R?#73.1
GND: C?#51.1 C?#52.1 C?#53.1 C?#54.1 C?#55.1 C?#56.1 CN?#22.3 CN?#23.3 CN?#24.3 CN?#25.3 CN?#26.3 CN?#27.3 R?#62.1 R?#63.1 R?#70.1 R?#71.1 R?#78.1 R?#79.1
NetC?#51_2: C?#51.2 R?#59.2 ; port DISTANCE.DIST4
NetC?#52_2: C?#52.2 R?#60.2 ; port DISTANCE.DIST3
NetC?#53_2: C?#53.2 R?#67.2 ; port DISTANCE.DIST5
NetC?#54_2: C?#54.2 R?#68.2 ; port DISTANCE.DIST2
NetC?#55_2: C?#55.2 R?#75.2 ; port DISTANCE.DIST6
NetC?#56_2: C?#56.2 R?#76.2 ; port DISTANCE.DIST1
NetCN?#22_1: CN?#22.1 R?#56.2
NetCN?#22_2: CN?#22.2 R?#58.2
NetCN?#23_1: CN?#23.1 R?#57.2
NetCN?#23_2: CN?#23.2 R?#61.2
NetCN?#24_1: CN?#24.1 R?#64.2
NetCN?#24_2: CN?#24.2 R?#66.2
NetCN?#25_1: CN?#25.1 R?#65.2
NetCN?#25_2: CN?#25.2 R?#69.2
NetCN?#26_1: CN?#26.1 R?#72.2
NetCN?#26_2: CN?#26.2 R?#74.2
NetCN?#27_1: CN?#27.1 R?#73.2
NetCN?#27_2: CN?#27.2 R?#77.2
NetR?#58_1: R?#58.1 R?#59.1 R?#62.2
NetR?#60_1: R?#60.1 R?#61.1 R?#63.2
NetR?#66_1: R?#66.1 R?#67.1 R?#70.2
NetR?#68_1: R?#68.1 R?#69.1 R?#71.2
NetR?#74_1: R?#74.1 R?#75.1 R?#78.2
NetR?#76_1: R?#76.1 R?#77.1 R?#79.2

### Notes on the sheet
- Size
- Date
- A4
- Title
- Sheet number
- Author
- Revision

### Library data of the parts
C?#51-C?#56 = Capacitor: Voltage: *; Value: 100nF
CN?#22-CN?#27 = Pins 1x3: as CN?#15 on sheet Servo; Distributor: Mouser; Package: SMD 1.27mm
R?#56 R?#57 R?#64 R?#65 R?#72 R?#73 = Resistor_Selection: Resistor; Value: *
R?#58-R?#63 R?#66-R?#71 R?#74-R?#79 = Resistor
  R?#58 R?#61 R?#66 R?#69 R?#74 R?#77: Value: 0R
  R?#59 R?#60 R?#67 R?#68 R?#75 R?#76: Value: 100R
  R?#62 R?#63 R?#70 R?#71 R?#78 R?#79: Value: DNP